# EasyEDA Pro project 4T模拟赛-董海玄.eprj

# Schematic SCH
Board Name: Board1; Create Date: 2026-03-23; Page Name: GD32 主控电路; Project Name: 4T模拟赛-董海玄; Schematic Name: SCH; Update Date: 2026-03-23
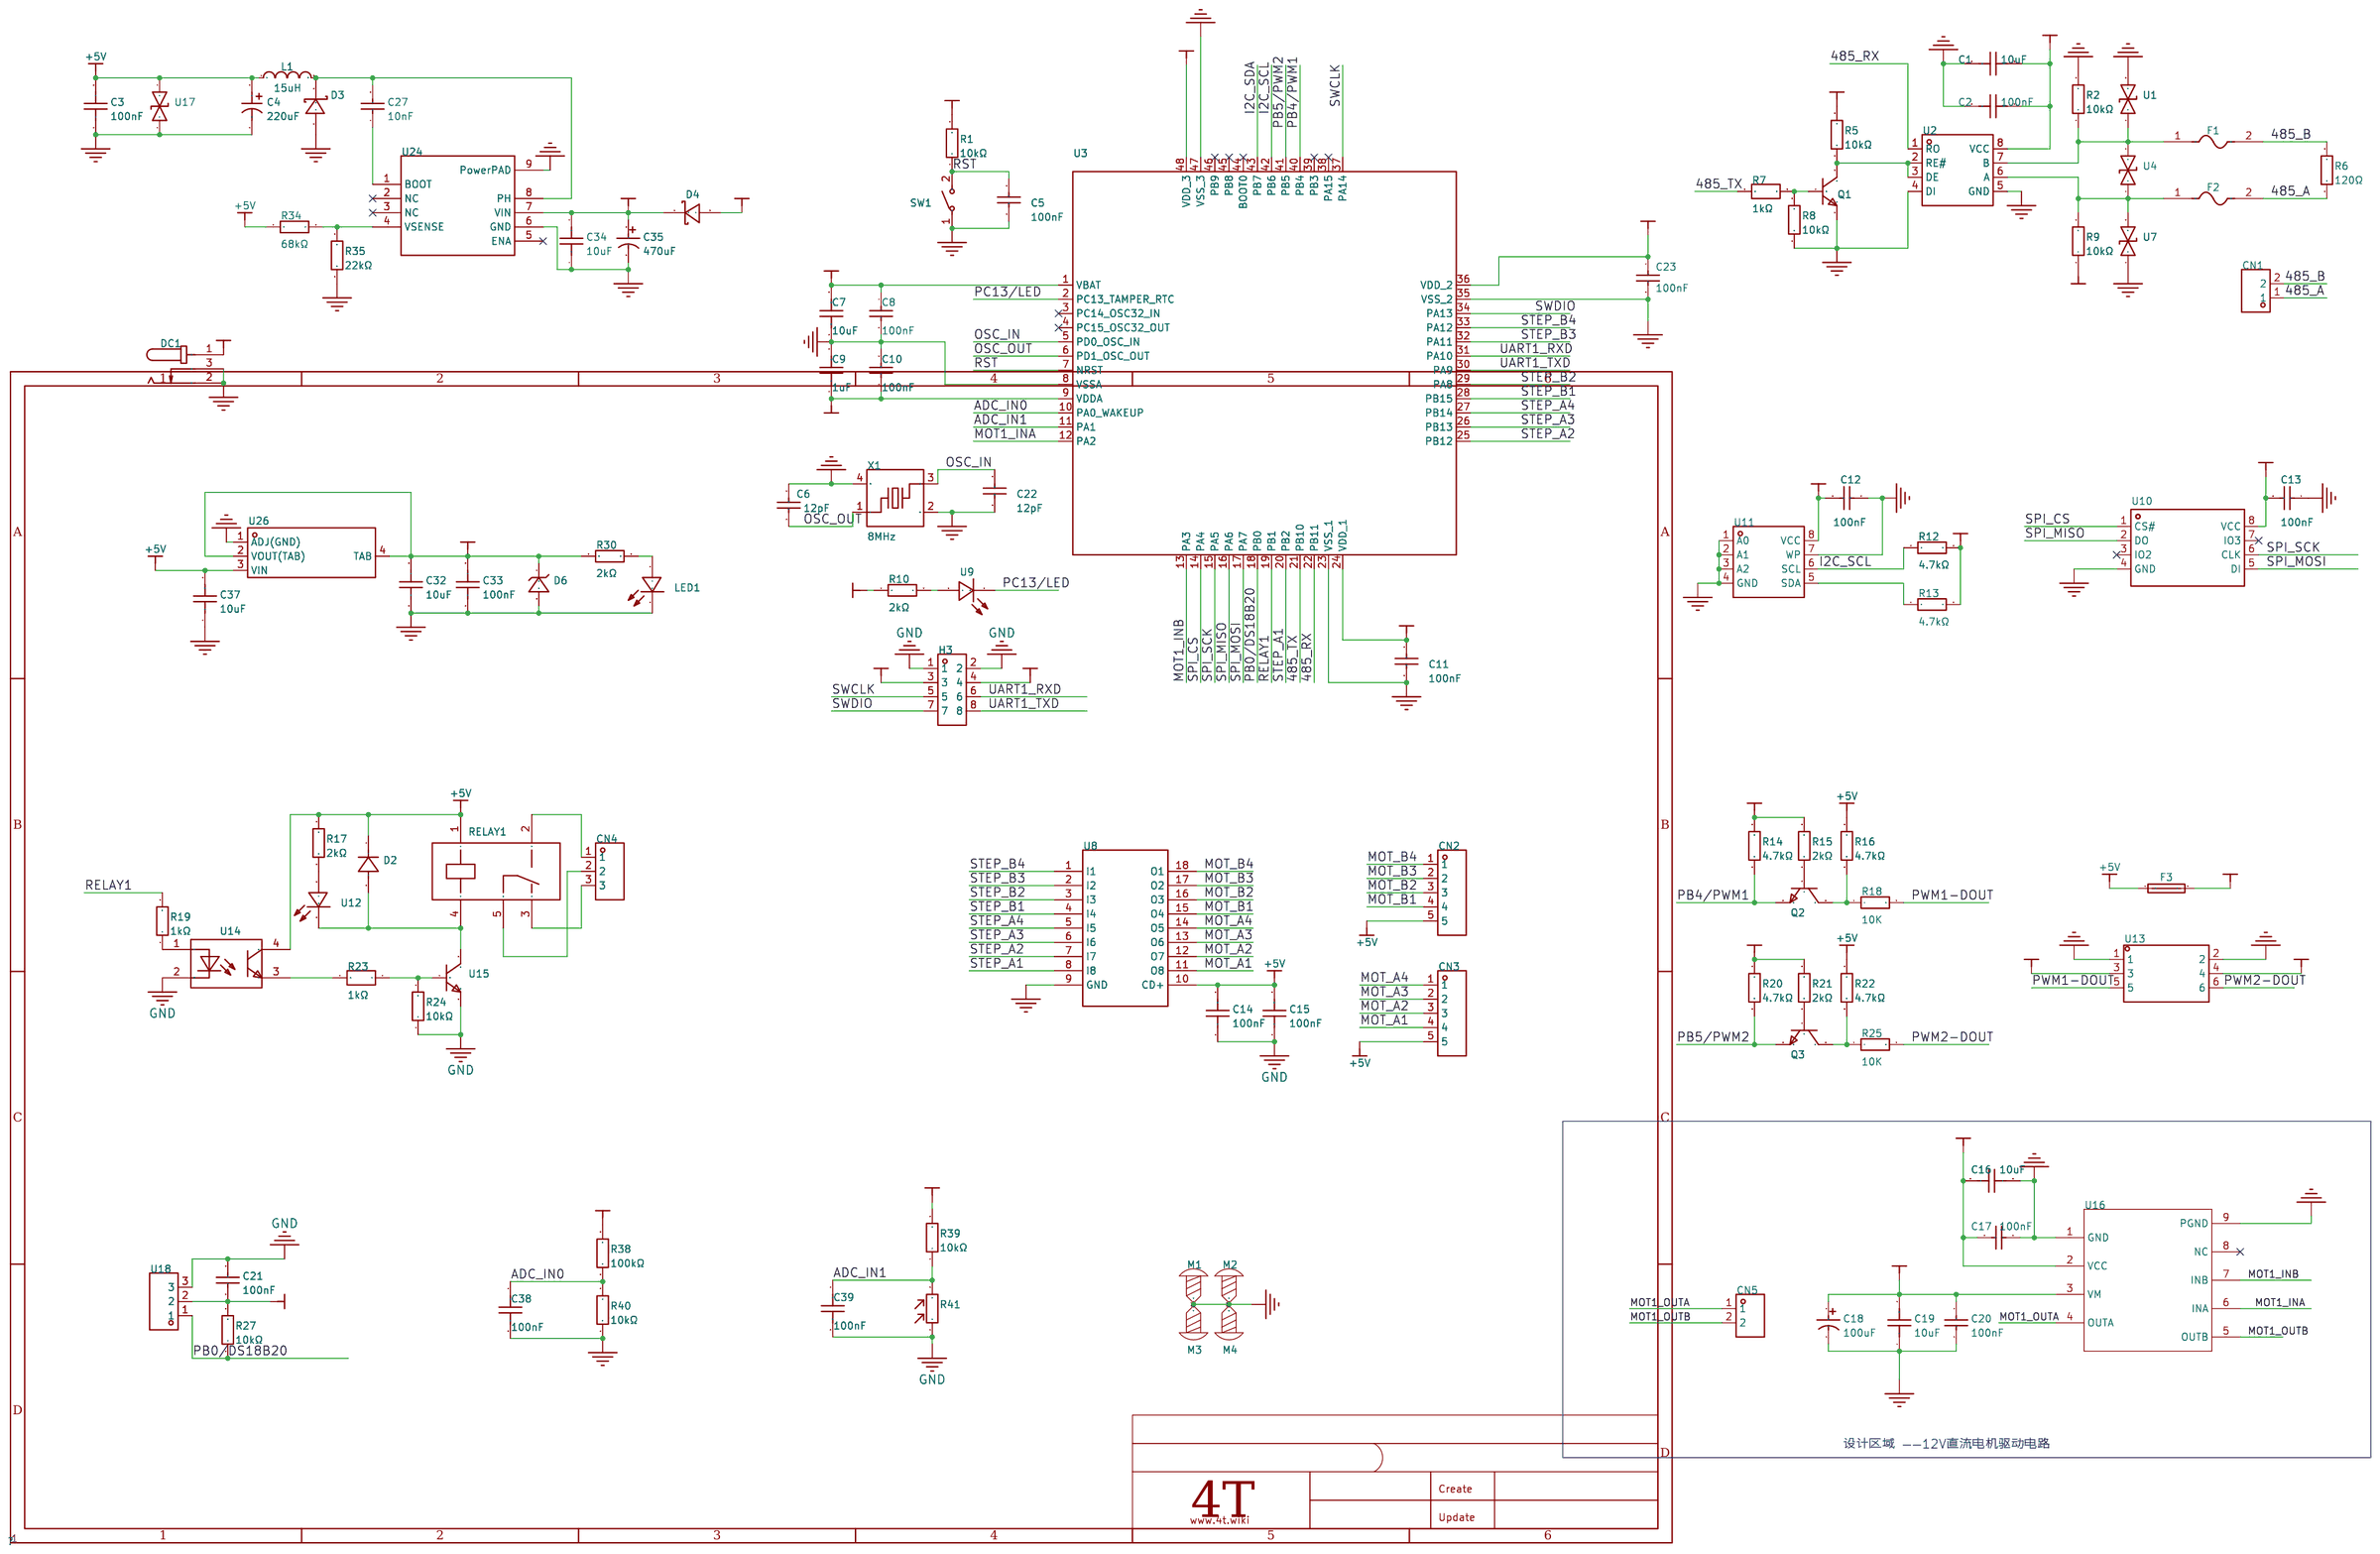
[diagram p0: schematic sheet]

## Parts
C1  10uF  [LQ_R0603]
C2  100nF  [LQ_R0603]
C3  100nF  [LQ_C0805]
C4  220uF  [LQ_CAP-SMD_BD6.3-L6.6-W6.6-LS7.3-FD-H7.7]
C5  100nF  [LQ_R0603]
C6  12pF  [LQ_R0603]
C7  10uF  [LQ_R0603]
C8  100nF  [LQ_R0603]
C9  1uF  [LQ_R0603]
C10  100nF  [LQ_R0603]
C11  100nF  [LQ_R0603]
C12  100nF  [LQ_R0603]
C13  100nF  [LQ_R0603]
C14  100nF  [LQ_C0805]
C15  100nF  [LQ_C0805]
C16  10uF  [LQ_R0603]
C17  100nF  [LQ_R0603]
C18  100uF  [LQ_CAP-SMD_BD6.3-L6.6-W6.6-LS7.3-FD-H7.7]
C19  10uF  [LQ_R0603]
C20  100nF  [LQ_R0603]
C21  100nF  [LQ_R0603]
C22  12pF  [LQ_R0603]
C23  100nF  [LQ_R0603]
C27  10nF  [LQ_R0603]
C32  10uF  [LQ_R0603]
C33  100nF  [LQ_R0603]
C34  10uF  [LQ_C0805]
C35  470uF  [LQ_CAP-SMD_BD8.0-L8.3-W8.3-FD]
C37  10uF  [LQ_R0603]
C38  100nF  [LQ_R0603]
C39  100nF  [LQ_R0603]
CN1  -  [LQ_CONN-TH_2P-P5.08_DB128L-5.08-2P]
CN2  -  [LQ_CONN-TH_5P-P2.54_XH-5AW_C2908614]
CN3  -  [LQ_CONN-TH_5P-P2.54_XH-5AW_C2908614]
CN4  -  [LQ_CONN-TH_3P-P5.00_KF2EDGR-5.0-3P]
CN5  -  [LQ_CONN-TH_2P-P5.08_DB128L-5.08-2P]
D2  1N4007  [LQ_SMA_L4.3-W2.5-LS5.0-RD]
D3  SS34  [LQ_SMA_L4.3-W2.6-LS5.0-RD]
D4  SS34  [LQ_SMA_L4.3-W2.6-LS5.0-RD]
D6  -  [LQ_SMB_L4.3-W3.6-LS5.3-RD]
DC1  -  [LQ_DC-IN-TH_DC-005-A200]
F1  -  [LQ_R0805]
F2  -  [LQ_R0805]
F3  -  [LQ_R0603]
H3  -  [LQ_HDR-TH_8P-P2.54-V-F-R2-C4-S2.54-1]
L1  15uH  [LQ_IND-SMD_L10.8-W10.0_SLO1040H]
LED1  -  [LQ_LED0603-RD]
M1  -  [LQ_M3螺丝]
M2  -  [LQ_M3螺丝]
M3  -  [LQ_M3螺丝]
M4  -  [LQ_M3螺丝]
Q1  -  [LQ_SC-75-3_L1.6-W0.8-P1.00-LS1.6-BR]
Q2  S8050-J3Y  [LQ_SOT-23-3_L3.0-W1.7-P0.95-LS2.9-BR]
Q3  S8050-J3Y  [LQ_SOT-23-3_L3.0-W1.7-P0.95-LS2.9-BR]
R1  10kΩ  [LQ_R0603]
R2  10kΩ  [LQ_R0603]
R5  10kΩ  [LQ_R0603]
R6  120Ω  [LQ_R0805]
R7  1kΩ  [LQ_R0603]
R8  10kΩ  [LQ_R0603]
R9  10kΩ  [LQ_R0603]
R10  2kΩ  [LQ_R0603]
R12  4.7kΩ  [LQ_R0603]
R13  4.7kΩ  [LQ_R0603]
R14  4.7kΩ  [LQ_R0603]
R15  2kΩ  [LQ_R0603]
R16  4.7kΩ  [LQ_R0603]
R17  2kΩ  [LQ_R0603]
R18  10K  [LQ_R0603]
R19  1kΩ  [LQ_R0603]
R20  4.7kΩ  [LQ_R0603]
R21  2kΩ  [LQ_R0603]
R22  4.7kΩ  [LQ_R0603]
R23  1kΩ  [LQ_R0603]
R24  10kΩ  [LQ_R0603]
R25  10K  [LQ_R0603]
R27  10kΩ  [LQ_R0603]
R30  2kΩ  [LQ_R0603]
R34  68kΩ  [LQ_R0603]
R35  22kΩ  [LQ_R0603]
R38  100kΩ  [LQ_R0603]
R39  10kΩ  [LQ_R0603]
R40  10kΩ  [LQ_R0603]
R41  -  [LQ_RES-TH_L5.1-W4.3-P3.40-D0.5]
RELAY1  -  [LQ_RELAY-TH_SRD-XXVDC-XL-C_1]
SW1  -  [LQ_SW-SMD_L6.0-W3.3-LS8.0]
U1  -  [LQ_SOD-123FL_L2.8-W1.8-LS3.7-BI]
U2  -  [LQ_SOP-8_L4.9-W3.9-P1.27-LS6.0-BL]
U3  -  [LQ_TQFP-48_L7.0-W7.0-P0.50-LS9.0-BL]
U4  -  [LQ_SOD-123FL_L2.8-W1.8-LS3.7-BI]
U7  -  [LQ_SOD-123FL_L2.8-W1.8-LS3.7-BI]
U8  -  [LQ_DIP-18_L23.0-W6.5-P2.54-LS7.6-BL]
U9  -  [LQ_LED-TH_BD3.9-P2.54-RD_GREEN]
U10  -  [LQ_SOIC-8_L5.3-W5.3-P1.27-LS8.0-BL]
U11  AT24C02  [LQ_SOP-8_L4.9-W3.9-P1.27-LS6.0-BL]
U12  -  [LQ_LED-TH_BD3.9-P2.54-RD_GREEN]
U13  -  [LQ_HDR-TH_6P-P2.54-H-R2-C3-S2.54-W10.0_MTP125-203R1]
U14  GX817C-S  [LQ_SOP-4_L6.5-W4.6-P2.54-LS10.2-TR]
U15  -  [LQ_SOT-23-3_L2.9-W1.3-P1.90-LS2.4-BR]
U16  -  [ESOP]
U17  -  [LQ_SOD-123FL_L2.8-W1.8-LS3.7-BI]
U18  -  [LQ_CONN-TH_3P-P5.08_DIBO_DB128V-5.08-3P-X]
U24  -  [LQ_ESOP-8_L4.9-W3.9-P1.27-LS6.0-TL-EP]
U26  -  [SOT-223-4_L6.5-W3.5-P2.30-LS7.0-BR]
X1  8MHz  [LQ_OSC-SMD_4P-L3.2-W2.5-BL]

## Library data of the parts
C1 C2 C5-C13 C16 C17 C19-C23 C27 C32 C33 C37-C39 = CAP_0603: Rect,100,35
C3 C14 C15 C34 = CAP_0805: Rect,130,53
C4 C18 = JVJ50V100M6x8: Round,260; LCSC Part Name: 100uF ±20% 50V; Supplier Footprint: SMD,D6.3xL7.7mm; JLCPCB Part Class: 扩展库; Datasheet: https://atta.szlcsc.com/upload/public/pdf/source/20250307/5A84A08C3F2F96A6D3F2CE3F7352019C.pdf; Tolerance: ±20%; Voltage Rating: 50V; Ripple Current: 140mA@100Hz; Diameter: 6.3mm; Height - Seated (Max): 7.7mm; Lifetime: 2000hrs@105℃; Operating Temperature: -55℃~+105℃
C35 = VT1V221M0810: Round,314; LCSC Part Name: 220uF ±20% 35V; Supplier Footprint: SMD,D8xL10.2mm; Datasheet: https://atta.szlcsc.com/upload/public/pdf/source/20181008/C310848_86A97ADD3BC640D301817E47C029682B.pdf; Tolerance: ±20%; Rated Voltage: 35V; φD: 8mm; L: 10.2mm; Lifetime @ Temp: 2000hrs@105℃; Operating Temperature: -45℃~+105℃
CN1 CN5 = DB128L-5.08-2P-GN-S: Rect,383,380; LCSC Part Name: 5.08mm 1x2P 排数:1 每排P数:2 直插; Supplier Footprint: 插件,P=5.08mm; Datasheet: https://atta.szlcsc.com/upload/public/pdf/source/20230106/B067FE0E641A396A370D47F93C345689.pdf; Structure: 1x2P; Pitch: 5.08mm; Color: 绿色; Mounting Style: 直插; Current Rating (Max): 18A; Voltage Rating (Max): 250V; Number of Pins: 2P; Number of Rows: 1; Wire Gauge - AWG: 12~30; Wire Gauge - mm2: 2.5; Number of PINs Per Row: 2; Operating Temperature Range: -40℃~+105℃
CN2 CN3 = XH-5AW: Rect,570,274; LCSC Part Name: 1x5P 间距:2.54mm 弯插 系列:XH; Supplier Footprint: 弯插,P=2.5mm; Datasheet: https://atta.szlcsc.com/upload/public/pdf/source/20230711/B565BAF3B11666EF6B81B3605408F2BD.pdf; Pins Structure: 1x5P; Pitch: 2.54mm; Mounting Style: 弯插; Reference Series: XH; Number of Pins: 5P; Number of Rows: 1; Number of PINs Per Row: 5; Current Rating (Max): 3A; Contact Material: 黄铜; Contact Plating: 锡; Operating Temperature Range: -25℃~+85℃
CN4 = KF2EDGR-5.0-3P: Rect,588,461; LCSC Part Name: 5mm 1x3P 排数:1 每排P数:3; Supplier Footprint: 弯插,P=5mm; Datasheet: https://atta.szlcsc.com/upload/public/pdf/source/20230331/48F85325430F02148BE2AB264324A8EA.pdf; Connector Type: 板端/插座-开口; Structure: 1x3P; Pitch: 5mm; Color: 绿色; Mounting Style: 弯针; Number of Pins: 3P; Number of Rows: 1; Number of PINs Per Row: 3; Current Rating (Max): 15A; Voltage Rating (Max): 300V; Operating Temperature Range: -40℃~+105℃
D2 = 1N4007_C727081: Rect,237,58; LCSC Part Name: 1kV 1A 1.1V@1A; Supplier Part: C727081; Manufacturer: TWGMC(台湾迪嘉); Supplier Footprint: SMA(DO-214AC); Datasheet: https://atta.szlcsc.com/upload/public/pdf/source/20200828/C727079_3A05254382567072883400655AE0ED46.pdf; Supplier: LCSC; Diode Configuration: 独立式; Reverse Voltage (Vr): 1kV; Average Rectified Current (Io): 1A; Forward Voltage (Vf@If): 1.1V@1A; Reverse Leakage Current: 5μA@1kV
D3 D4 = SS34: Rect,184,107; Supplier Part: C9900023345; Supplier Footprint: SMA,DO-214AC; Supplier: LCSC
D6 = SMBJ3.3A_C2990571: Rect,190,130; LCSC Part Name: SMBJ3.3A; Supplier Footprint: SMB(DO-214AA); Datasheet: https://atta.szlcsc.com/upload/public/pdf/source/20180716/C29715_E6EABBF81195B419C59879CD6F1DD929.pdf; Reverse Stand-Off Voltage (Vrwm): 3.3V; Maximum Clamping Voltage: 7.2V; Peak Pulse Current (Ipp)@10/1000us: 42A; Peak Pulse Power Dissipation (Ppp)@10/1000us: 300W; Breakdown Voltage: 4V; Reverse Leakage Current (Ir): 10uA; Type: TVS
DC1 = DC-005-A200: Rect,533,335; LCSC Part Name: DC电源插座 内径:2mm 外径:6.4mm; Supplier Footprint: 插件; JLCPCB Part Class: 扩展库; Datasheet: https://atta.szlcsc.com/upload/public/pdf/source/20200812/C720557_2286DFCD6C75B71AF905731F627ABF3A.pdf; Connector Type: DC电源插座; Mounting Style: 弯插; Inside Contact Diameter: 2mm; Outside Contact Diameter: 6.4mm; Current Rating (Max): 3A; Voltage Rating (Max): 30V; Operating Temperature Range: -20℃~+70℃
F1 F2 = 0805L100/12AR: Rect,154,63; LCSC Part Name: 12V 1A 0805自恢复; Supplier Footprint: 0805; Datasheet: https://atta.szlcsc.com/upload/public/pdf/source/20230807/C79B608779D6C1962D0609D5DE753A5D.pdf; Operating Voltage (Max): 12V; Current Rating (Max): 40A; Hold Current: 1A; Trip Current: 2A; Power Dissipation: 800mW; Resistance - Initial (Ri) (Min): 40mΩ; Resistance - Post Trip (R1) (Max): 270mΩ; Maximum Time to Trip: 300ms; Operating Temperature: -40℃~+85℃
F3 = BSMD0603L-100: Rect,86,27; LCSC Part Name: 6V 1A 0603自恢复; Supplier Footprint: 0603; Datasheet: https://atta.szlcsc.com/upload/public/pdf/source/20230512/417309B2F369BEFF09D3B47B4F479194.pdf; Operating Voltage (Max): 6V; Current Rating (Max): 50A; Hold Current: 1A; Trip Current: 2A; Power Dissipation: 1W; Resistance - Initial (Ri) (Min): 9mΩ; Resistance - Post Trip (R1) (Max): 80mΩ; Maximum Time to Trip: 500ms; Operating Temperature: -40℃~+85℃
H3 = HDR-F_2.54_2x4: Rect,405,186; Supplier Footprint: 插件
L1 = SLO1040H470MTT: Rect,431,399; LCSC Part Name: 47uH ±20%; Supplier Footprint: SMD; JLCPCB Part Class: 扩展库; Datasheet: https://atta.szlcsc.com/upload/public/pdf/source/20201009/C207854_ACA4210DD273ACBB198904FC5A3A8806.pdf; Tolerance: ±20%; Rated Current: 3A; DC Resistance (DCR): 145mΩ
LED1 = KT-0603R: Rect,92,33; LCSC Part Name: 0603 红灯 高亮; Supplier Footprint: 0603; Datasheet: https://atta.szlcsc.com/upload/public/pdf/source/20160616/1466072038404.pdf; Emitted Color: 红色; Operating Temperature: -40℃~+85℃
M1-M4 = M3螺丝孔: Round,210
Q1 = MMBT3904TT1G: Rect,29,63; LCSC Part Name: NPN 电流:200mA 耐压:40V; Supplier Footprint: SOT-416; Datasheet: https://atta.szlcsc.com/upload/public/pdf/source/20221020/8C70A8ED36C1D333CEA0E7EE045B4434.pdf; Transistor Type: NPN; Collector Current (Ic): 200mA; Collector-Emitter Breakdown Voltage (Vceo): 40V; Power Dissipation (Pd): 200mW; DC Current Gain (hFE@Ic,Vce): 100@0.1mA,1.0V; Transition Frequency (fT): 300MHz; Collector Cut-Off Current (Icbo): 50nA; Collector-Emitter Saturation Voltage (VCE(sat)@Ic,Ib): 200mV@10mA,1.0mA; Operating Temperature: -65℃~+150℃
Q2 Q3 = S8050-J3Y: Rect,67,120; Pin Type: IN
R1 R2 R5 R7-R10 R12-R25 R27 R30 R34 R35 R38-R40 = Res_0603: Rect,95,37
R6 = Res_0805: Rect,125,54
R41 = GL5528: Round,162; LCSC Part Name: 亮电阻:8kΩ~20kΩ 暗电阻:1MΩ; Supplier Footprint: 插件,P=3mm; Datasheet: https://atta.szlcsc.com/upload/public/pdf/source/20230427/842A99E3D53A83729D7968886D4EFCBB.pdf; Dark Resistance: 1MΩ; Illuminated Resistance @ 10Lux: 8kΩ~20kΩ; Applied Voltage: 150V; Spectral Peak: 540nm
RELAY1 = SRD-12VDC-SL-C: Rect,740,600; Supplier Footprint: 插件,15.6x19.2mm; Datasheet: https://atta.szlcsc.com/upload/public/pdf/source/20200305/C490149_C96E4098A3B1FFB377D5AD2E40B7C2A8.pdf; Coil Voltage: 12V; Contact Form: 一组转换:1C(单刀双掷-转换); Pin Number: 5; Maximum Switching Voltage: 250V@AC; Coil Rated Power: 360mW; Maximum Switching Current: 15A; Coil Type: 无极性-单线圈; Coil Resistance: 400Ω; Contact Resistance: 100mΩ; Operate Time: 10ms; Release Time: 10ms
SW1 = TS-1101-C-W: Rect,236,129; LCSC Part Name: 6*3.6*2.5mm 立贴 轻触开关; Supplier Footprint: SMD; Datasheet: https://atta.szlcsc.com/upload/public/pdf/source/20200227/C318938_C2E53B1EEDE37D980A33616AC086DE53.pdf; Circuit: 单刀单掷; Actuator Style: 矩形按钮; Operating Force: 260gf; Mounting Style: 立贴; Switch Length: 6mm; Switch Width: 3.6mm; Switch Height: 2.5mm; Strike Gundam: 不带; Contact Current: 50mA; Voltage Rating (DC): 12V; Actuator/Cap Color: 白色带淡绿; With Lamp: 无; Mechanical Life: 5万次; Operating Temperature: -30℃~+85℃
U1 U4 U7 U17 = SMF6.0CA_C2990473: Rect,173,48; LCSC Part Name: SMF6.0CA; Supplier Footprint: SOD-123FL; Datasheet: https://atta.szlcsc.com/upload/public/pdf/source/20231227/BBF9EE757846DE4D601D73FF261316E0.pdf; Reverse Stand-Off Voltage (Vrwm): 6V; Maximum Clamping Voltage: 10.3V; Peak Pulse Current (Ipp)@10/1000us: 19.4A; Peak Pulse Power Dissipation (Ppp)@10/1000us: 200W; Breakdown Voltage: 6.67V; Reverse Leakage Current (Ir): 400uA; Type: TVS
U2 = SP3485EN-MS: Rect,196,115; Supplier Footprint: SOP-8; Datasheet: https://atta.szlcsc.com/upload/public/pdf/source/20230802/AC5CE9B297C842978E478FFAEC87FC06.pdf; Types: 收发器; Supply Voltage: 3V~5.5V; Data Rate: 12Mbps; Driver/receiver: 1/1; Node Number: 256; Operating Temperature: -40℃~+125℃
U3 = GD32F103C8T6: Rect,216,216; LCSC Part Name: Arm® Cortex®-M3 32-bit MCU; Supplier Footprint: LQFP-48(7x7); Datasheet: https://item.szlcsc.com/datasheet/GD32F103C8T6/79128.html; CPU Core: ARM Cortex-M3; CPU Maximum Speed: 108MHz; Program Storage Size: 64KB; Program Memory Type: FLASH; Number of I/O: 37; ADC (Bit): 12bit; Voltage - Supply: 2.6V~3.6V
U8 = ULN2803G-D18-T: Rect,889,235; Supplier Footprint: DIP-18; Datasheet: https://atta.szlcsc.com/upload/public/pdf/source/20160620/1466410514366.pdf; number of channels: 八路
U9 U12 = L-3N4GD: Round,140; Supplier Footprint: 插件,D=3mm; Datasheet: https://atta.szlcsc.com/upload/public/pdf/source/20220613/52FE11107FC1247DC989221133187A30.pdf; Lamp Holder Type: 3mm圆柱形灯头
U10 = W25Q128JVSIQ: Rect,207,171; LCSC Part Name: W25Q128JVSIQ 编带; Supplier Footprint: SOIC-8-208mil; JLCPCB Part Class: 基础库; Datasheet: https://atta.szlcsc.com/upload/public/pdf/source/20170316/1489627409956.pdf; Interface Type: SPI; Memory Size: 128Mbit; Clock Frequency (fc): 133MHz; Supply Voltage: 2.7V~3.6V; Page Programming Time (Tpp): 700us; Block Erase Time (tBE): 120ms@(32KB); Data Retention - TDR (Year): 20年; Operating Temperature: -40℃~+85℃
U11 = AT24C02: Rect,196,115; link: https://so.szlcsc.com/global.html?k=C356696&ref=editor
U13 = MTP125-1203R1: Rect,250,529; LCSC Part Name: 2.54mm 2x3P 弯插 方针; Supplier Footprint: 弯插,P=2.54mm; Datasheet: https://atta.szlcsc.com/upload/public/pdf/source/20190124/C358705_93D7A3916447F5E30395220E465CA216.pdf; Number of Rows: 双排; Number of Pins: 6; Pitch: 2.54mm; Pin Structure: 2x3P; Row Spacing: 2.54mm; Mounting Type: 弯插; Circluar Pins/Square Pins: 方针; Length of Mating Pin: 6mm; Insulation Height: 2.5mm; Contact Material: 黄铜; Operating Temperature Range: -40℃~+105℃; Color: 黑色
U14 = GX817C-S: Rect,154,463; LCSC Part Name: DC输入 隔离电压(rms):5000V; Supplier Part: C2684625; Manufacturer: 国芯佳品; Supplier Footprint: SOP-4-2.54mm; Datasheet: https://atta.szlcsc.com/upload/public/pdf/source/20210129/C2684625_70920EABE5B67CAA0A333F7D1CED43F0.pdf; Supplier: LCSC; Input voltage type: DC; Output Type: 光电三极管; Number of Outputs: 1; Forward Voltage: 1.2V; Reverse Voltage: 6V; Output Current: 50mA; Receiving End Voltage: 35V; Collector-Emitter Saturation Voltage (Vce(sat)@Ic,IF): 100mV@1mA,20mA; Rise time: 18us@2mA,100Ω; Fall time: 18us@2mA,100Ω; Isolation Voltage(rms): 5kV; Operating Temperature: -55℃~+110℃
U15 = SS8050_C7420370: Rect,53,116; LCSC Part Name: 耐压:25V 电流:1.5A NPN H档 200-350; Supplier Footprint: SOT-23; Datasheet: https://atta.szlcsc.com/upload/public/pdf/source/20231222/9C4050A7669EB24B3ACD0418218817FD.pdf; Transistor Type: NPN; Collector Current (Ic): 1.5A; Collector-Emitter Breakdown Voltage (Vceo): 25V; Power Dissipation (Pd): 300mW; DC Current Gain (hFE@Ic,Vce): 120@100mA,1.0V; Transition Frequency (fT): 100MHz; Collector Cut-Off Current (Icbo): 100nA; Collector-Emitter Saturation Voltage (VCE(sat)@Ic,Ib): 500mV@800mA,80mA; Operating Temperature: -55℃~+150℃
U16 = BDR
U18 = DB128V-5.08-3P-GN-S: Rect,600,394; LCSC Part Name: 1x3P 5.08mm 直插 排数:1 每排P数:3; Supplier Footprint: 插件,P=5.08mm; JLCPCB Part Class: 扩展库; Datasheet: https://atta.szlcsc.com/upload/public/pdf/source/20230106/CC449C10514519CDCE20F1C37DBF2DAC.pdf; Number of Positions or Pins: 1x3P; Pitch: 5.08mm; Color: 绿色; Mounting Type: 直插; Number of Pins: 3P; Number of Rows: 1; Number of PINs Per Row: 3; Screw Specification: M2.5; Current Rating: 16A; Voltage Rating (Max): 300V; Wire Gauge - AWG: 12~22; Wire Gauge - mm2: 2.5; Operating Temperature: -40℃~+105℃
U24 = TPS5430DDAR: Rect,159,190; LCSC Part Name: 宽输入范围、3A输出电流的降压转换器; Supplier Footprint: SOIC-8-EP; Datasheet: https://www.ti.com/cn/lit/gpn/tps5430; Function: 降压型; Output Type: 可调; Input Voltage: 5.5V~36V; Output Voltage: 1.221V~32.04V; Output Current: 3A; Switching Frequency: 500kHz; Operating Temperature: -40℃~+125℃@(TJ); Synchronous Rectification: 否; Number of Outputs: 1; Topology: 降压式; Switch tube (built-in/external): 内置
U26 = AMS1117-1.8_C6185: Rect,90,248; LCSC Part Name: 正 Vin=15V Vout=1.8V~1.8V 1A 75dB@(120Hz); Supplier Footprint: SOT-223-4; Datasheet: https://atta.szlcsc.com/upload/public/pdf/source/20180727/C6186_7A095716F0823C02F1997A905E26C086.pdf; Output Type: 固定; Output Polarity: 正; Number of Outputs: 1; Maximum Input Voltage: 15V; Output Voltage: 1.8V~1.8V; Dropout Voltage: 1.3V@(1A); Output Current: 1A; Power Supply Rejection Ratio (PSRR): 75dB@(120Hz)
X1 = X322512MSB4SI: Rect,159,130; LCSC Part Name: 12MHz ±10ppm 20pF; Supplier Footprint: SMD3225-4P; Datasheet: https://atta.szlcsc.com/upload/public/pdf/source/20240329/19D5F850207469550BEB00D7DFEDBC7A.pdf; Crystal Type: 贴片晶振; Normal temperature Frequency Tolerance: ±10ppm; External load capacitor: 20pF; Frequency Stability(Full temperature range): ±20ppm; Operating Temperature: -40℃~+85℃

## Nets
3V3: C1.1 C2.1 C7.2 C8.1 C9.1 C10.1 C11.1 C12.1 C13.2 C16.1 C17.2 C21.2 C23.1 C32.2 C33.2 D6.1(C) H3.3 H3.4 R1.2 R5.2 R9.1 R10.1 R12.2 R13.2 R14.1 R15.2 R20.1 R21.2 R27.2 R30.2 R39.2 U2.8(VCC) U3.1(VBAT) U3.9(VDDA) U3.24(VDD_1) U3.36(VDD_2) U3.48(VDD_3) U10.8(VCC) U11.8(VCC) U16.2(VCC) U18.2 U26.2(VOUT(TAB)) U26.4(TAB)
+5V: C3.2 C4.1 C14.2 C15.2 C37.2 CN2.5 CN3.5 D2.1(K) F3.1 L1.1 R16.1 R17.1 R22.1 R34.1 RELAY1.1 U8.10(CD+) U14.4(C) U17.1 U26.3(VIN)
+5V-OUT: F3.2 U13.3 U13.4
+12V: C18.1 C19.2 C20.1 C34.2 C35.1 D4.1(K) U16.3(VM) U24.7(VIN)
GND: C1.2 C2.2 C3.1 C4.2 C5.2 C6.2 C7.1 C8.2 C9.2 C10.2 C11.2 C12.2 C13.1 C14.1 C15.1 C16.2 C17.1 C18.2 C19.1 C20.2 C21.1 C22.1 C23.2 C32.1 C33.1 C34.1 C35.2 C37.1 C38.2 C39.2 D3.2(A) D6.2(A) DC1.2 DC1.3 H3.1 H3.2 LED1.1(K) M1.1 M2.1 M3.1 M4.1 Q1.2(E) R2.2 R8.1 R24.1 R35.1 R40.1 R41.1 SW1.1 U1.2 U2.4(DI) U2.5(GND) U3.8(VSSA) U3.23(VSS_1) U3.35(VSS_2) U3.47(VSS_3) U7.1 U8.9(GND) U10.4(GND) U11.1(A0) U11.2(A1) U11.3(A2) U11.4(GND) U11.7(WP) U13.1 U13.2 U14.2(C) U15.2(E) U16.1(GND) U16.9(PGND) U17.2 U18.3 U24.6(GND) U24.9(PowerPAD) U26.1(ADJ(GND)) X1.2(GND) X1.4(GND)
VIN: D4.2(A) DC1.1 R38.2
485_A: CN1.1 F2.2 R6.1
485_B: CN1.2 F1.2 R6.2
485_RX: U2.1(RO) U3.22(PB11)
485_TX: R7.1 U3.21(PB10)
ADC_IN0: C38.1 R38.1 R40.2 U3.10(PA0_WAKEUP)
ADC_IN1: C39.1 R39.1 R41.2 U3.11(PA1)
I2C_SCL: R12.1 U3.42(PB6) U11.6(SCL)
I2C_SDA: U3.43(PB7)
MOT1_INA: U3.12(PA2) U16.6(INA)
MOT1_INB: U3.13(PA3) U16.7(INB)
MOT1_OUTA: CN5.1 U16.4(OUTA)
MOT1_OUTB: CN5.2 U16.5(OUTB)
MOT_A1: CN3.4 U8.11(O8)
MOT_A2: CN3.3 U8.12(O7)
MOT_A3: CN3.2 U8.13(O6)
MOT_A4: CN3.1 U8.14(O5)
MOT_B1: CN2.4 U8.15(O4)
MOT_B2: CN2.3 U8.16(O3)
MOT_B3: CN2.2 U8.17(O2)
MOT_B4: CN2.1 U8.18(O1)
OSC_IN: C22.2 U3.5(PD0_OSC_IN) X1.3
OSC_OUT: C6.1 U3.6(PD1_OSC_OUT) X1.1
PB0/DS18B20: R27.1 U3.18(PB0) U18.1
PB4/PWM1: Q2.2 R14.2 U3.40(PB4)
PB5/PWM2: Q3.2 R20.2 U3.41(PB5)
PC13/LED: U3.2(PC13_TAMPER_RTC) U9.1(C)
PWM1-DOUT: R18.2 U13.5
PWM2-DOUT: R25.2 U13.6
RELAY1: R19.2 U3.19(PB1)
RST: C5.1 R1.1 SW1.2 U3.7(NRST)
SPI_CS: U3.14(PA4) U10.1(CS#)
SPI_MISO: U3.16(PA6) U10.2(DO)
SPI_MOSI: U3.17(PA7) U10.5(DI)
SPI_SCK: U3.15(PA5) U10.6(CLK)
STEP_A1: U3.20(PB2) U8.8(I8)
STEP_A2: U3.25(PB12) U8.7(I7)
STEP_A3: U3.26(PB13) U8.6(I6)
STEP_A4: U3.27(PB14) U8.5(I5)
STEP_B1: U3.28(PB15) U8.4(I4)
STEP_B2: U3.29(PA8) U8.3(I3)
STEP_B3: U3.32(PA11) U8.2(I2)
STEP_B4: U3.33(PA12) U8.1(I1)
SWCLK: H3.5 U3.37(PA14)
SWDIO: H3.7 U3.34(PA13)
UART1_RXD: H3.6 U3.31(PA10)
UART1_TXD: H3.8 U3.30(PA9)
$1N1864: R10.2 U9.2(A)
$1N51292: Q3.1 R21.1
$1N51297: Q3.3 R22.2 R25.1
$1N64291: Q1.3(C) R5.1 U2.2(RE#) U2.3(DE)
$1N64303: F1.1 R2.1 U1.1 U2.7(B) U4.2
$1N64306: F2.1 R9.2 U2.6(A) U4.1 U7.2
$1N64546: Q1.1(B) R7.2 R8.2
$1N100307: R23.2 U14.3(E)
$1N100313: CN4.3 RELAY1.3
$1N100314: R23.1 R24.2 U15.1(B)
$1N100315: D2.2(A) RELAY1.4 U12.1(C) U15.3(C)
$1N100316: CN4.1 RELAY1.2
$1N100317: CN4.2 RELAY1.5
$1N101166: R19.1 U14.1(A)
$1N101509: Q2.1 R15.1
$1N101514: Q2.3 R16.2 R18.1
$1N108709: R17.2 U12.2(A)
$1N118569: LED1.2(A) R30.1
$1N118588: C27.2 D3.1(K) L1.2 U24.8(PH)
$1N118591: R34.2 R35.2 U24.4(VSENSE)
$1N118592: C27.1 U24.1(BOOT)
Net-(R13-1): R13.1 U11.5(SDA)

Not connected (* = marked no-connect by the designer): U3 3(PC14_OSC32_IN)* 4(PC15_OSC32_OUT)* 38(PA15)* 39(PB3)* 44(BOOT0)* 45(PB8)* 46(PB9)*; U10 3(IO2)* 7(IO3)*; U16 8(NC)*; U24 2(NC)* 3(NC)* 5(ENA)*

## Notes on the sheet
- 设计区域 ——12V直流电机驱动电路

# Board PCB
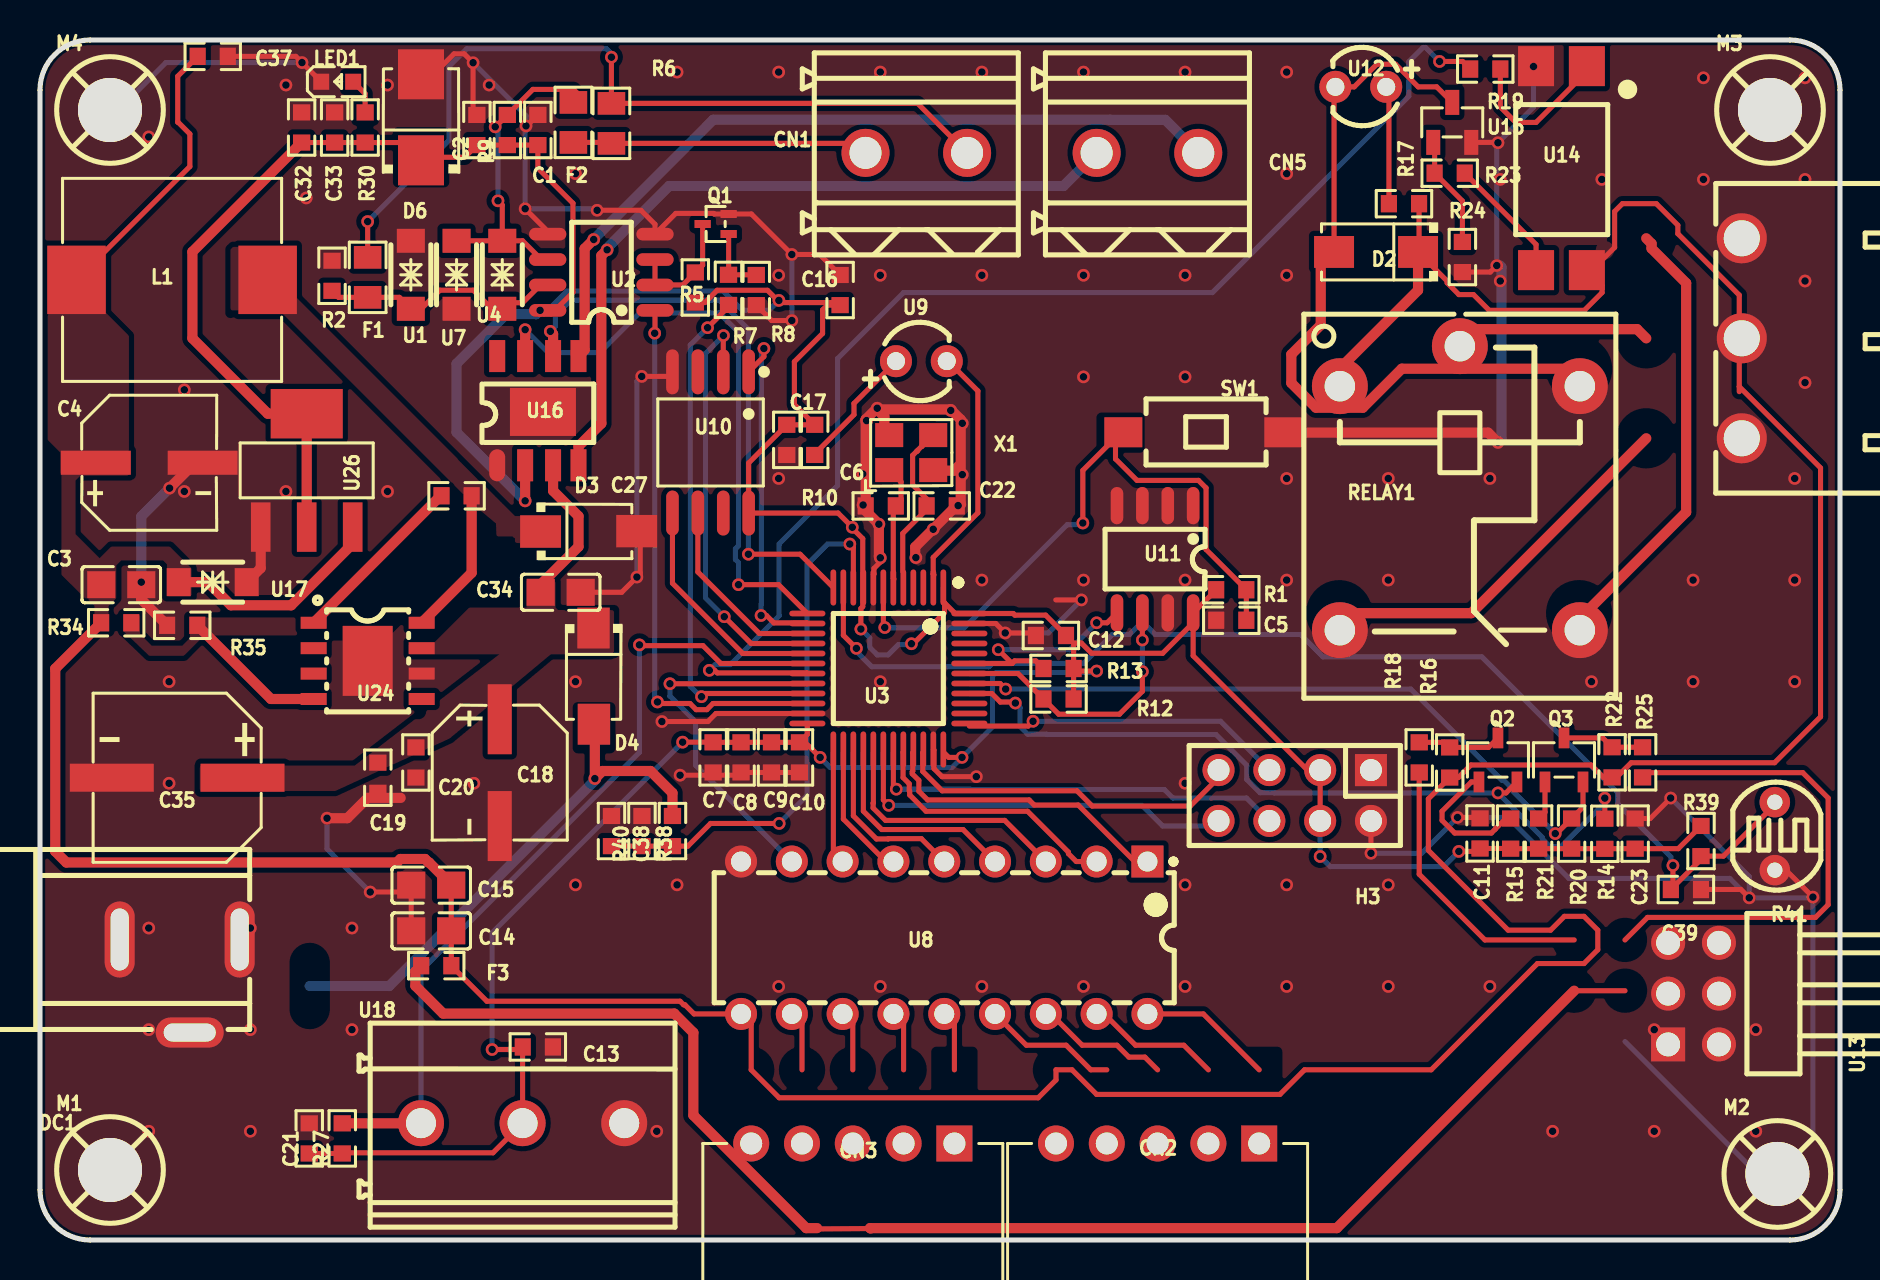
[diagram p1: board, top side]
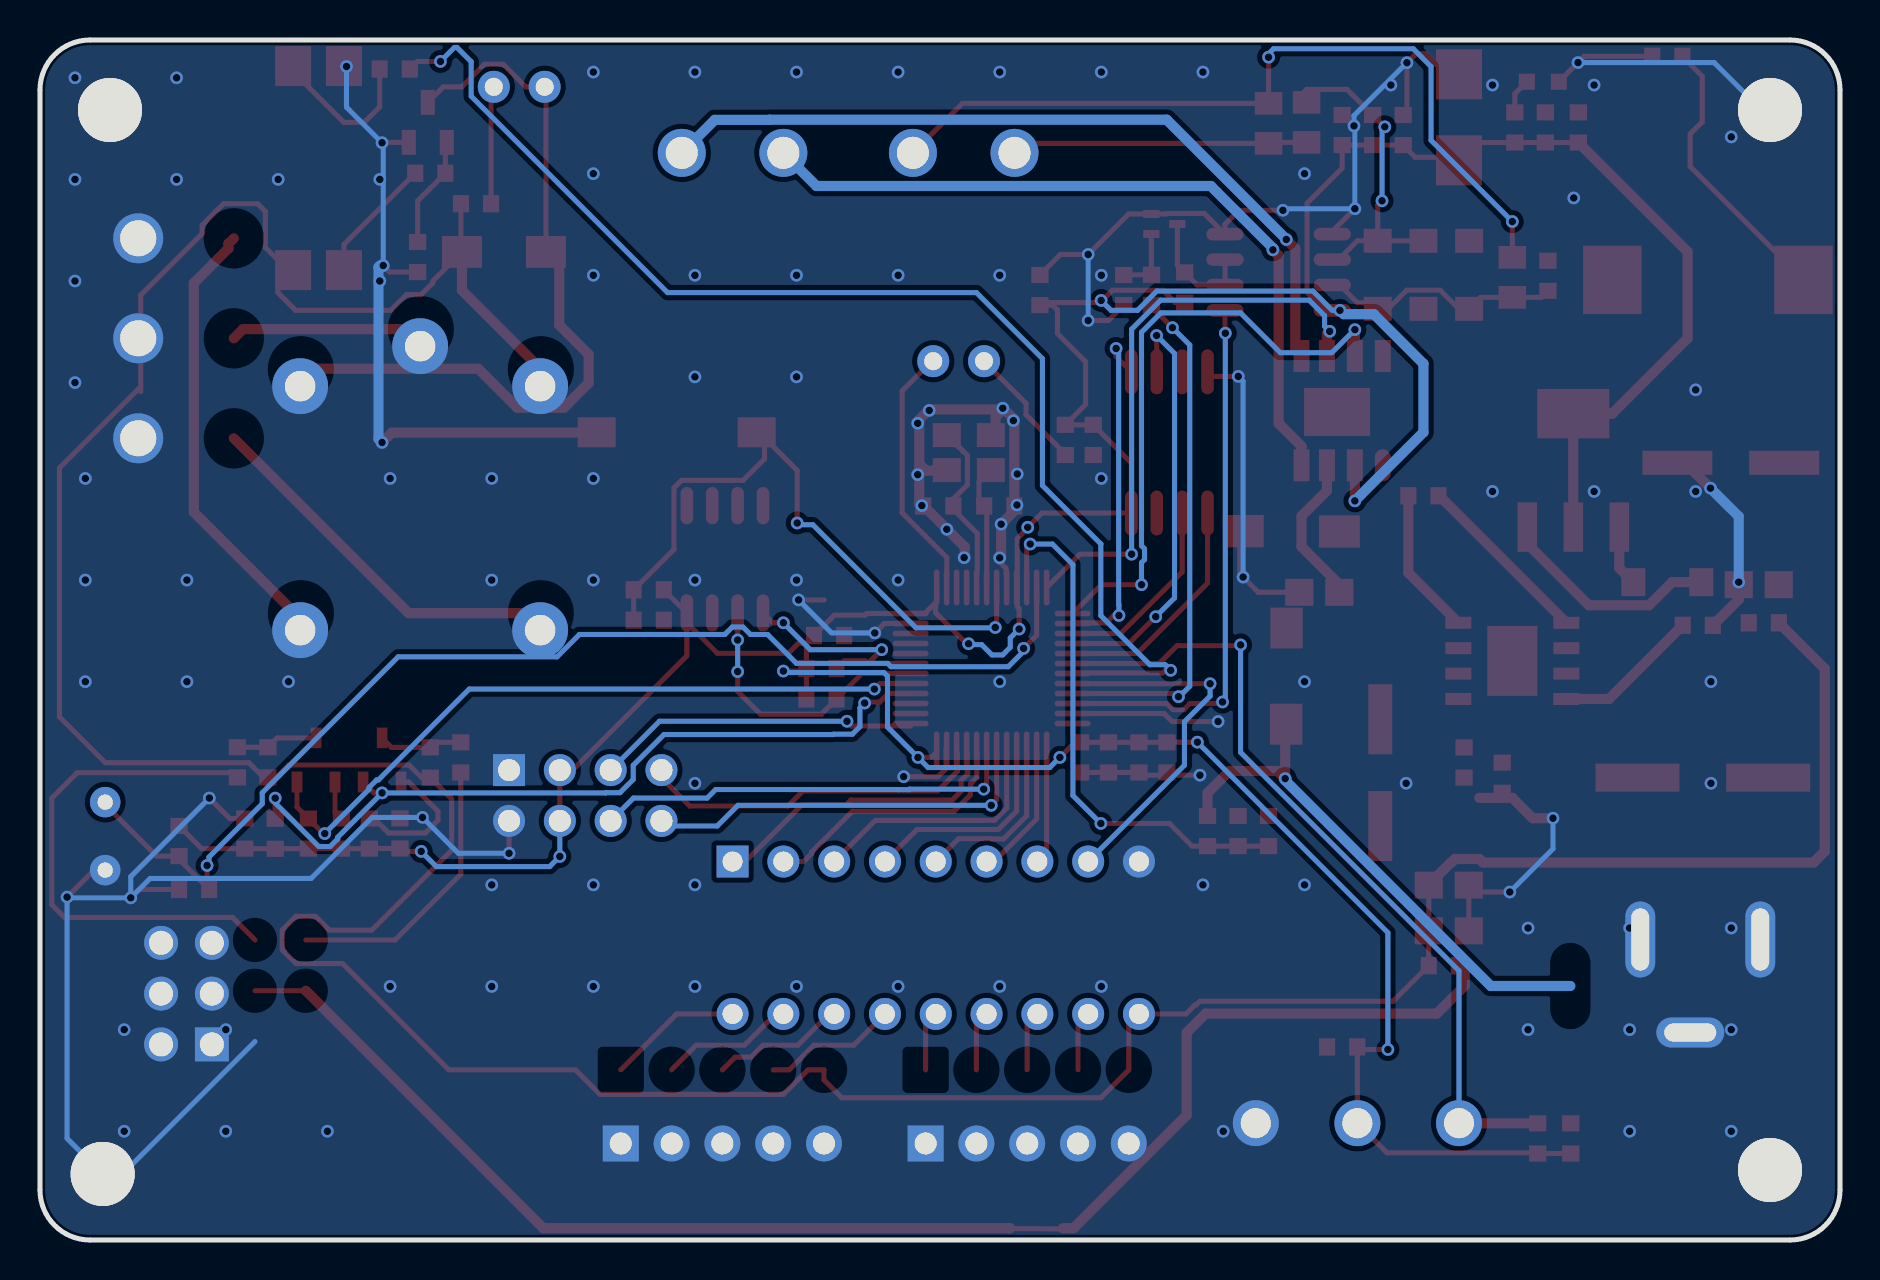
[diagram p2: board, bottom side, seen from below]

Outline 90 x 60 mm; copper layers: Top Layer, Bottom Layer. Coordinates in mm from the lower left corner of the outline.
Outline path: 0,57.5 0,2.5 arc(0.73,0.73) 2.5,0 87.5,0 arc(89.27,0.73) 90,2.5 90,57.5 arc(89.27,59.27) 87.5,60 2.5,60 arc(0.73,59.27) 0,57.5
Stack: Top Layer 0.035mm / Dielectric1 1.51mm FR4 er 4.5 / Bottom Layer 0.035mm

## Design rules (mm)
template: 自定义配置
spacing copperThickness1oz (default): track to track 0.203, other pairs 0.178 to 0.203
spacing copperThickness2oz: track to track 0.203, other pairs 0.152 to 0.3
track width copperThickness1oz (default): min 0.254, default 0.254, max 2.54
track width copperThickness2oz: min 0.203, default 0.254, max 2.54
differential pair differentialPair (default): width min 0.127, default 0.254, max 2.54; gap min 0.152, default 0.152
via viaSize (default): diameter min 0.635, default 0.635, max 10.16; hole min 0.381, default 0.381, max 10.16

## Placement (name value [footprint] x y rotation side)
C1  10uF  [LQ_R0603]  24.89 55.5 90 top
C2  100nF  [LQ_R0603]  21.84 55.5 90 top
C3  100nF  [LQ_C0805]  4.06 32.77 180 top
C4  220uF  [LQ_CAP-SMD_BD6.3-L6.6-W6.6-LS7.3-FD-H7.7]  5.46 38.86 0 top
C5  100nF  [LQ_R0603]  59.56 30.99 180 top
C6  12pF  [LQ_R0603]  42.04 36.7 180 top
C7  10uF  [LQ_R0603]  33.66 24.13 90 top
C8  100nF  [LQ_R0603]  35.05 24.13 270 top
C9  1uF  [LQ_R0603]  36.58 24.13 270 top
C10  100nF  [LQ_R0603]  37.97 24.13 270 top
C11  100nF  [LQ_R0603]  72 20.33 90 top
C12  100nF  [LQ_R0603]  50.55 30.23 180 top
C13  100nF  [LQ_R0603]  24.89 9.65 180 top
C14  100nF  [LQ_C0805]  19.56 15.46 0 top
C15  100nF  [LQ_C0805]  19.56 17.74 0 top
C16  10uF  [LQ_R0603]  40 47.5 90 top
C17  100nF  [LQ_R0603]  37.34 40 90 top
C18  100uF  [LQ_CAP-SMD_BD6.3-L6.6-W6.6-LS7.3-FD-H7.7]  22.99 23.37 270 top
C19  10uF  [LQ_R0603]  16.89 23.11 90 top
C20  100nF  [LQ_R0603]  18.8 23.88 270 top
C21  100nF  [LQ_R0603]  13.46 5.08 270 top
C22  12pF  [LQ_R0603]  45.09 36.7 180 top
C23  100nF  [LQ_R0603]  79.76 20.32 90 top
C27  10nF  [LQ_R0603]  20.83 37.21 0 top
C32  10uF  [LQ_R0603]  13.08 55.63 270 top
C33  100nF  [LQ_R0603]  14.73 55.63 270 top
C34  10uF  [LQ_C0805]  26.03 32.39 180 top
C35  470uF  [LQ_CAP-SMD_BD8.0-L8.3-W8.3-FD]  6.86 23.11 180 top
C37  10uF  [LQ_R0603]  8.64 59.18 180 top
C38  100nF  [LQ_R0603]  30.1 20.45 90 top
C39  100nF  [LQ_R0603]  82.3 17.53 0 top
CN1  -  [LQ_CONN-TH_2P-P5.08_DB128L-5.08-2P]  43.81 54.36 0 top
CN2  -  [LQ_CONN-TH_5P-P2.54_XH-5AW_C2908614]  55.88 4.83 180 top
CN3  -  [LQ_CONN-TH_5P-P2.54_XH-5AW_C2908614]  40.64 4.83 180 top
CN4  -  [LQ_CONN-TH_3P-P5.00_KF2EDGR-5.0-3P]  85.09 45.08 90 top
CN5  -  [LQ_CONN-TH_2P-P5.08_DB128L-5.08-2P]  55.37 54.36 0 top
D2  1N4007  [LQ_SMA_L4.3-W2.5-LS5.0-RD]  66.8 49.4 180 top
D3  SS34  [LQ_SMA_L4.3-W2.6-LS5.0-RD]  27.43 35.43 0 top
D4  SS34  [LQ_SMA_L4.3-W2.6-LS5.0-RD]  27.69 28.19 270 top
D6  -  [LQ_SMB_L4.3-W3.6-LS5.3-RD]  19.05 56.13 90 top
DC1  -  [LQ_DC-IN-TH_DC-005-A200]  6.98 12.7 0 top
F1  -  [LQ_R0805]  16.38 48.13 90 top
F2  -  [LQ_R0805]  26.67 55.88 270 top
F3  -  [LQ_R0603]  19.81 13.72 180 top
H3  -  [LQ_HDR-TH_8P-P2.54-V-F-R2-C4-S2.54-1]  62.74 22.22 180 top
L1  15uH  [LQ_IND-SMD_L10.8-W10.0_SLO1040H]  6.6 48.01 180 top
LED1  -  [LQ_LED0603-RD]  14.86 57.91 0 top
M1  -  [LQ_M3螺丝]  3.5 3.5 0 top
M2  -  [LQ_M3螺丝]  86.87 3.3 0 top
M3  -  [LQ_M3螺丝]  86.5 56.5 0 top
M4  -  [LQ_M3螺丝]  3.5 56.5 0 top
Q1  -  [LQ_SC-75-3_L1.6-W0.8-P1.00-LS1.6-BR]  33.78 50.8 0 top
Q2  S8050-J3Y  [LQ_SOT-23-3_L3.0-W1.7-P0.95-LS2.9-BR]  72.9 24 270 top
Q3  S8050-J3Y  [LQ_SOT-23-3_L3.0-W1.7-P0.95-LS2.9-BR]  76.2 24 270 top
R1  10kΩ  [LQ_R0603]  59.56 32.51 180 top
R2  10kΩ  [LQ_R0603]  14.6 48.21 90 top
R5  10kΩ  [LQ_R0603]  32.77 47.62 270 top
R6  120Ω  [LQ_R0805]  28.57 55.83 90 top
R7  1kΩ  [LQ_R0603]  34.43 47.51 90 top
R8  10kΩ  [LQ_R0603]  35.81 47.5 90 top
R9  10kΩ  [LQ_R0603]  23.37 55.5 90 top
R10  2kΩ  [LQ_R0603]  38.74 40 270 top
R12  4.7kΩ  [LQ_R0603]  50.93 27.05 0 top
R13  4.7kΩ  [LQ_R0603]  50.93 28.58 0 top
R14  4.7kΩ  [LQ_R0603]  78.24 20.31 90 top
R15  2kΩ  [LQ_R0603]  73.53 20.32 270 top
R16  4.7kΩ  [LQ_R0603]  70.49 23.88 90 top
R17  2kΩ  [LQ_R0603]  68.2 51.82 180 top
R18  10K  [LQ_R0603]  68.96 24.13 270 top
R19  1kΩ  [LQ_R0603]  72.26 58.55 180 top
R20  4.7kΩ  [LQ_R0603]  76.58 20.32 90 top
R21  2kΩ  [LQ_R0603]  74.93 20.32 270 top
R22  4.7kΩ  [LQ_R0603]  78.6 23.88 90 top
R23  1kΩ  [LQ_R0603]  70.49 53.34 0 top
R24  10kΩ  [LQ_R0603]  71.12 49.15 90 top
R25  10K  [LQ_R0603]  80.13 23.88 270 top
R27  10kΩ  [LQ_R0603]  15.11 5.08 270 top
R30  2kΩ  [LQ_R0603]  16.26 55.63 270 top
R34  68kΩ  [LQ_R0603]  3.81 30.86 0 top
R35  22kΩ  [LQ_R0603]  7.11 30.73 0 top
R38  100kΩ  [LQ_R0603]  31.62 20.45 90 top
R39  10kΩ  [LQ_R0603]  83.05 19.95 90 top
R40  10kΩ  [LQ_R0603]  28.57 20.45 270 top
R41  -  [LQ_RES-TH_L5.1-W4.3-P3.40-D0.5]  86.74 20.19 180 top
RELAY1  -  [LQ_RELAY-TH_SRD-XXVDC-XL-C_1]  70.99 37.59 270 top
SW1  -  [LQ_SW-SMD_L6.0-W3.3-LS8.0]  58.17 40.39 180 top
U1  -  [LQ_SOD-123FL_L2.8-W1.8-LS3.7-BI]  18.54 48.26 90 top
U2  -  [LQ_SOP-8_L4.9-W3.9-P1.27-LS6.0-BL]  28.07 48.39 90 top
U3  -  [LQ_TQFP-48_L7.0-W7.0-P0.50-LS9.0-BL]  42.42 28.58 180 top
U4  -  [LQ_SOD-123FL_L2.8-W1.8-LS3.7-BI]  23.11 48.26 270 top
U7  -  [LQ_SOD-123FL_L2.8-W1.8-LS3.7-BI]  20.83 48.26 90 top
U8  -  [LQ_DIP-18_L23.0-W6.5-P2.54-LS7.6-BL]  45.21 15.11 180 top
U9  -  [LQ_LED-TH_BD3.9-P2.54-RD_GREEN]  44.07 43.94 180 top
U10  -  [LQ_SOIC-8_L5.3-W5.3-P1.27-LS8.0-BL]  33.53 39.88 180 top
U11  AT24C02  [LQ_SOP-8_L4.9-W3.9-P1.27-LS6.0-BL]  55.75 34.04 180 top
U12  -  [LQ_LED-TH_BD3.9-P2.54-RD_GREEN]  66.04 57.66 0 top
U13  -  [LQ_HDR-TH_6P-P2.54-H-R2-C3-S2.54-W10.0_MTP125-203R1]  82.68 12.32 90 top
U14  GX817C-S  [LQ_SOP-4_L6.5-W4.6-P2.54-LS10.2-TR]  76.07 53.59 0 top
U15  -  [LQ_SOT-23-3_L2.9-W1.3-P1.90-LS2.4-BR]  70.61 55.88 270 top
U16  -  [ESOP]  22.86 38.73 0 top
U17  -  [LQ_SOD-123FL_L2.8-W1.8-LS3.7-BI]  8.64 32.89 0 top
U18  -  [LQ_CONN-TH_3P-P5.08_DIBO_DB128V-5.08-3P-X]  24.13 5.84 0 top
U24  -  [LQ_ESOP-8_L4.9-W3.9-P1.27-LS6.0-TL-EP]  16.38 28.96 0 top
U26  -  [SOT-223-4_L6.5-W3.5-P2.30-LS7.0-BR]  13.33 38.48 270 top
X1  8MHz  [LQ_OSC-SMD_4P-L3.2-W2.5-BL]  43.56 39.37 0 top

## Footprints (pads in the part's own frame, mm; a bottom-side part is the same pattern mirrored in y, then rotated)
ESOP
  oval 0.8x1.6 smd: 1(0,0)
  rect 0.8x1.6 smd: 2(1.397,0) 3(2.794,0) 4(4.064,0) 5(4.064,5.461) 6(2.794,5.461) 7(1.397,5.461) 8(0,5.461)
  rect 3.3x2.4 smd: 9(2.286,2.667)
LQ_C0805
  rect 1.41x1.35 smd: 1(-1,0) 2(1,0)
LQ_CAP-SMD_BD6.3-L6.6-W6.6-LS7.3-FD-H7.7
  rect 3.5x1.2 smd: 1(-2.67,0) 2(2.67,0)
LQ_CAP-SMD_BD8.0-L8.3-W8.3-FD
  rect 4.2x1.4 smd: 1(-3.267,0) 2(3.267,0)
LQ_CONN-TH_2P-P5.08_DB128L-5.08-2P
  round 2.4 hole 1.6: 1(-2.54,0) 2(2.54,0)
LQ_CONN-TH_3P-P5.00_KF2EDGR-5.0-3P
  round 2.5 hole 1.8: 1(-5,0) 2(0,0) 3(5,0)
LQ_CONN-TH_3P-P5.08_DIBO_DB128V-5.08-3P-X
  round 2.3 hole 1.5: 1(-5.08,0) 2(0,0) 3(5.08,0)
LQ_CONN-TH_5P-P2.54_XH-5AW_C2908614
  rect 1.8x1.8 hole 1.1: 1(-5.08,0)
  round 1.8 hole 1.1: 2(-2.54,0) 3(0,0) 4(2.54,0) 5(5.08,0)
LQ_DC-IN-TH_DC-005-A200
  oval 1.5x3.8 hole 0.9x3.1: 1(3,2.325) 2(-3,2.325)
  oval 3.4x1.5 hole 2.6x0.9: 3(0.5,-2.325)
LQ_DIP-18_L23.0-W6.5-P2.54-LS7.6-BL
  rect 1.6x1.6 hole 1: 1(-10.16,-3.81)
  round 1.6 hole 1: 2(-7.62,-3.81) 3(-5.08,-3.81) 4(-2.54,-3.81) 5(0,-3.81) 6(2.54,-3.81) 7(5.08,-3.81) 8(7.62,-3.81) 9(10.16,-3.81) 10(10.16,3.81) 11(7.62,3.81) 12(5.08,3.81) 13(2.54,3.81) 14(0,3.81) 15(-2.54,3.81) 16(-5.08,3.81) 17(-7.62,3.81) 18(-10.16,3.81)
LQ_ESOP-8_L4.9-W3.9-P1.27-LS6.0-TL-EP
  rect 1.3x0.6 smd: 1(-2.7,1.905) 2(-2.7,0.635) 3(-2.7,-0.635) 4(-2.7,-1.905) 5(2.7,-1.905) 6(2.7,-0.635) 7(2.7,0.635) 8(2.7,1.905)
  rect 2.5x3.5 smd: 9(0,0)
LQ_HDR-TH_6P-P2.54-H-R2-C3-S2.54-W10.0_MTP125-203R1
  rect 1.7x1.7 hole 1.2: 1(-2.54,1.27)
  round 1.7 hole 1.2: 2(-2.54,-1.27) 3(0,1.27) 4(0,-1.27) 5(2.54,1.27) 6(2.54,-1.27)
LQ_HDR-TH_8P-P2.54-V-F-R2-C4-S2.54-1
  rect 1.6x1.6 hole 1.1: 1(-3.81,-1.27)
  round 1.6 hole 1.1: 2(-3.81,1.27) 3(-1.27,-1.27) 4(-1.27,1.27) 5(1.27,-1.27) 6(1.27,1.27) 7(3.81,-1.27) 8(3.81,1.27)
LQ_IND-SMD_L10.8-W10.0_SLO1040H
  rect 2.924x3.42 smd: 1(4.778,0) 2(-4.778,0)
LQ_LED0603-RD
  rect 0.8x0.8 smd: 1(-0.799,0) 2(0.799,0)
LQ_LED-TH_BD3.9-P2.54-RD_GREEN
  round 1.6 hole 0.9: 1(-1.27,0) 2(1.27,0)
LQ_M3螺丝
  round 3.2 hole 3.2: 1(0,0)
LQ_OSC-SMD_4P-L3.2-W2.5-BL
  rect 1.4x1.2 smd: 1(-1.1,-0.875) 2(1.1,-0.875) 3(1.1,0.875) 4(-1.1,0.875)
LQ_R0603
  rect 0.806x0.864 smd: 1(-0.753,0) 2(0.753,0)
LQ_R0805
  rect 1.133x1.377 smd: 1(-1,0) 2(1,0)
LQ_RELAY-TH_SRD-XXVDC-XL-C_1
  round 2.794 hole 1.524: 1(-5.1,-6) 2(7.1,-6) 3(7.1,6) 4(-5.1,6) 5(-7.1,0)
LQ_RES-TH_L5.1-W4.3-P3.40-D0.5
  round 1.524 hole 0.762: 1(0,1.7) 2(0,-1.7)
LQ_SC-75-3_L1.6-W0.8-P1.00-LS1.6-BR
  rect 0.816x0.4 smd: 1(0.65,-0.5) 2(0.65,0.5) 3(-0.65,0)
LQ_SMA_L4.3-W2.5-LS5.0-RD
  rect 2x1.593 smd: 1(-2.1,0) 2(2.1,0)
LQ_SMA_L4.3-W2.6-LS5.0-RD
  rect 2.046x1.62 smd: 1(-2.404,-0.009) 2(2.404,0.009)
LQ_SMB_L4.3-W3.6-LS5.3-RD
  rect 2.5x2.3 smd: 1(-2.15,0) 2(2.15,0)
LQ_SOD-123FL_L2.8-W1.8-LS3.7-BI
  rect 1.2x1.4 smd: 1(-1.7,0) 2(1.7,0)
LQ_SOIC-8_L5.3-W5.3-P1.27-LS8.0-BL
  oval 0.63x2.25 smd: 1(-1.905,-3.53) 2(-0.635,-3.53) 3(0.635,-3.53) 4(1.905,-3.53) 5(1.905,3.53) 6(0.635,3.53) 7(-0.635,3.53) 8(-1.905,3.53)
LQ_SOP-4_L6.5-W4.6-P2.54-LS10.2-TR
  rect 1.8x2 smd: 1(1.27,5.1) 2(-1.27,5.1) 3(-1.27,-5.1) 4(1.27,-5.1)
LQ_SOP-8_L4.9-W3.9-P1.27-LS6.0-BL
  oval 0.63x1.865 smd: 1(-1.905,-2.683) 2(-0.635,-2.683) 3(0.635,-2.683) 4(1.905,-2.683) 5(1.905,2.683) 6(0.635,2.683) 7(-0.635,2.683) 8(-1.905,2.683)
LQ_SOT-23-3_L2.9-W1.3-P1.90-LS2.4-BR
  rect 1.25x0.7 smd: 1(1,-0.95) 2(1,0.95) 3(-1,0)
LQ_SOT-23-3_L3.0-W1.7-P0.95-LS2.9-BR
  rect 1.038x0.532 smd: 1(1.101,-0.95) 2(1.101,0.95) 3(-1.101,0)
LQ_SW-SMD_L6.0-W3.3-LS8.0
  rect 1.9x1.5 smd: 1(-4,0) 2(4,0)
LQ_TQFP-48_L7.0-W7.0-P0.50-LS9.0-BL
  oval 0.28x1.8 smd: 1(-2.75,-4.05) 2(-2.25,-4.05) 3(-1.75,-4.05) 4(-1.25,-4.05) 5(-0.75,-4.05) 6(-0.25,-4.05) 7(0.25,-4.05) 8(0.75,-4.05) 9(1.25,-4.05) 10(1.75,-4.05) 11(2.25,-4.05) 12(2.75,-4.05) 25(2.75,4.05) 26(2.25,4.05) 27(1.75,4.05) 28(1.25,4.05) 29(0.75,4.05) 30(0.25,4.05) 31(-0.25,4.05) 32(-0.75,4.05) 33(-1.25,4.05) 34(-1.75,4.05) 35(-2.25,4.05) 36(-2.75,4.05)
  oval 1.8x0.28 smd: 13(4.05,-2.75) 14(4.05,-2.25) 15(4.05,-1.75) 16(4.05,-1.25) 17(4.05,-0.75) 18(4.05,-0.25) 19(4.05,0.25) 20(4.05,0.75) 21(4.05,1.25) 22(4.05,1.75) 23(4.05,2.25) 24(4.05,2.75) 37(-4.05,2.75) 38(-4.05,2.25) 39(-4.05,1.75) 40(-4.05,1.25) 41(-4.05,0.75) 42(-4.05,0.25) 43(-4.05,-0.25) 44(-4.05,-0.75) 45(-4.05,-1.25) 46(-4.05,-1.75) 47(-4.05,-2.25) 48(-4.05,-2.75)
SOT-223-4_L6.5-W3.5-P2.30-LS7.0-BR
  rect 2.47x0.98 smd: 1(2.835,-2.3) 2(2.835,0) 3(2.835,2.3)
  rect 2.47x3.6 smd: 4(-2.835,0)

## Nets
As in the schematic, except:
I2C_SDA: R13.1 U3.43 U11.5

Pads without a net: U3 3 4 38 39 44 45 46; U10 3 7; U16 8; U24 2 3 5

## Via types
v1: diameter 0.635, hole 0.381, Top Layer to Bottom Layer, 176 vias

## Routing (per net, layer and track width the routed paths; a pad name or vN(x,y) marks a point on that pad's centre or on a via; arc(x,y) is an arc through that point)
3V3: length 232.8
  Top Layer w0.254: 45.17,24.4 45.44,24.13 v1(46.1,24.13) ; v1(32.13,24.89) 33.65,24.89 C7.2 ; 83.05,20.7 81.91,19.57 C23.1 R20.1 R21.2 R15.2 73.52,19.58 C11.1 71.86,19.43 v1(70.94,19.43) ; 38.37,25.7 38.37,25.28 C10.1 ; 45.23,31.86 45.17,31.92 U3.1 ; 45.23,31.86 45.76,31.33 U3.48 48.66,31.33 48.74,31.24 50.28,31.24 C12.1 ; 45.23,31.86 45.23,31.37 43.67,29.81 v1(43.57,29.81) ; v1(52.83,28.45) 51.81,28.45 R13.2 ; C10.1 38.25,24.88 v1(39.01,24.13) ; C10.1 C9.1 C8.1 33.91,24.88 ; R13.2 51.68,29.84 52.07,29.84 52.58,29.34 56.13,29.34 57.66,30.86 ; R13.2 51.68,27.18 ; 15.11,4.36 22.65,4.36 U18.2 24.13,9.64 ; R5.2 33.24,46.87 33.86,47.49 36.37,47.49 36.88,46.98 v1(36.94,46.98) 36.94,46.92 36.99,46.87 39.88,46.87 C16.1 39.37,46.74 39.13,46.5 39.13,45.32 37.72,43.92 37.72,41.77 R10.1 C17.2 35.43,38.85 U10.8 39.9,36.35 v1(40.61,35.64) 40.76,35.49 40.76,35.45 41.14,35.07 41.14,31.67 41.04,31.58 v1(41.04,30.55) ; 57.66,30.86 U11.8 58.81,32.5 R1.2 ; 57.66,30.86 57.66,29.21 63.37,23.5 64.01,23.5 H3.4 ; 24.13,9.64 24.01,9.53 v1(22.61,9.53) ; 24.13,9.64 C13.2 ; R27.2 C21.2 ; C32.2 C33.2 R30.2 18.32,54.87 19.06,54.14 21.24,54.14 C2.1 R9.1 C1.1 24.89,53.59 26.65,51.84 26.65,47.39 25.56,46.3 25.18,46.3 v1(25,46.48)
  Top Layer w0.508: U16.2 v1(24.26,36.96) ; C32.2 7.62,49.41 7.62,45.08 11.39,41.32 U26.4 U26.2
  Bottom Layer w0.254: H3.4 v1(64.01,19.18) 64.52,18.67 70.18,18.67 v1(70.94,19.43) ; v1(39.01,24.13) 39.51,23.62 45.59,23.62 v1(46.1,24.13) 47.62,25.65 47.62,28.19 47.8,28.37 52.76,28.37 v1(52.83,28.45) ; v1(41.04,30.55) 41.49,30.11 41.49,29.63 41.87,29.25 42.4,29.25 42.92,29.77 43.57,29.77 ; v1(32.13,24.89) 22.61,15.37 v1(22.61,9.53) ; v1(25,46.48) 25.39,46.48 26.35,47.45 34.16,47.45 35.12,46.48 36.45,46.48 v1(36.94,46.98)
  Bottom Layer w0.508: v1(25,46.48) 24.81,46.29 23.3,46.29 20.83,43.81 20.83,40.39 v1(24.26,36.96)
+5V: length 221.6
  Top Layer w0.254: R17.1 68.95,49.45 D2.1 70.36,47.95 70.36,47.86 70.94,47.27 71.67,47.27 72.46,46.48 77.22,46.48 78.1,47.37 78.1,47.73 U14.4 ; 77.6,48.49 78.73,49.63 78.73,51.43 79.12,51.82 80.81,51.82 81.89,50.74 81.89,50.31 84.96,47.24 84.96,42.67 ; C15.2 C14.2 20.57,15.45 F3.1 22.34,11.94 32,11.94 32.18,11.76 32.25,11.76 32.7,11.3 U8.10 35.56,10.79 35.56,8.51 36.96,7.11 49.91,7.11 50.8,8 50.8,8.51 51.6,8.51 52.83,7.28 62,7.28 63.23,8.51 69.56,8.51 74.87,13.82 77.2,13.82 77.89,14.51 77.89,15.49 77.2,16.18 76.22,16.18 75.53,15.49 73.41,15.49 69.42,19.48 69.42,22.06 R16.1 70.92,23.12 71.54,23.75 77.55,23.75 78.18,23.12 78.6,23.12 R22.1 78.83,23.13 79.56,23.86 86.73,23.86 89.03,26.16 89.03,38.6 84.96,42.67 ; 84.96,42.67 84.96,42.42 ; L1.1 7.49,53.67 7.49,55.3 6.9,55.89 6.89,55.89 6.89,58.19 C37.2
  Top Layer w0.508: 15.64,35.65 15.64,34.81 12.56,31.74 9.55,31.74 8.39,32.89 U17.1 ; D2.1 68.9,47.49 64.96,43.54 ; C15.2 20.56,17.77 19.45,18.88 19.43,18.88 19.25,19.05 18.02,19.05 17.84,18.88 1.32,18.88 0.76,19.43 0.76,28.57 R34.1
+5V-OUT: length 74
  Top Layer w0.254: 76.71,12.46 79.25,12.46 ; 38.85,0.55 41.53,0.57
  Top Layer w0.508: F3.2 18.77,13.43 18.77,12.71 20.16,11.32 31.72,11.32 32.67,10.37 32.67,6.24 38.31,0.59 38.85,0.59 ; 76.71,12.46 64.84,0.59 41.51,0.59 41.53,0.57
+12V: length 7.7
  Top Layer w0.508: U16.3 25.65,37.46 26.92,36.19 26.92,34.67 25.03,32.78 C34.2
GND: length 249.3
  Top Layer w0.254: v1(31.1,25.92) 33.4,25.92 33.8,26.33 U3.23 ; v1(42.02,34.11) 42.02,33.9 41.7,33.58 41.7,33.3 41.67,33.27 ; v1(24.26,51.56) 25.38,50.43 U2.5 ; 19.06,58.44 19.83,58.44 20.7,59.31 21.21,59.31 v1(21.65,58.86) 21.65,56.44 C2.2 ; v1(30.09,43.18) 31.4,43.18 U10.4 ; v1(16.51,17.4) 18.22,17.4 C15.1 C14.1 ; U15.2 72.88,54.88 v1(72.9,54.86) ; v1(88.65,17.14) 87.3,18.49 86.87,18.49 ; C37.1 12.79,59.18 v1(13.1,58.87) LED1.1 ; U3.35 44.7,24.5 44.7,23.57 45.1,23.17 v1(46.82,23.17) ; v1(32,23.24) 33.52,23.24 ; 33.52,23.24 C7.1 ; 33.52,23.24 34.92,23.24 C8.2 C9.2 C10.2 ; C39.2 85.04,17.53 v1(85.46,17.11) ; v1(70.88,21.13) 71.95,21.13 C11.2 ; C12.2 49.67,30.35 v1(48.26,30.35) 47.79,30.83 U3.47 ; R24.1 72.51,48.4 v1(72.84,48.72) ; 50.79,32 v1(52.07,32) ; v1(24.3,55.7) 24.34,55.7 C1.2 ; v1(37.59,45.97) 36.58,45.97 R8.1 ; 30.01,35.45 30.01,33.32 v1(29.84,33.15) 29.08,32.39 C34.1 ; H3.2 v1(66.55,19.34) ; C23.2 80.51,21.07 v1(81.53,22.1) ; C16.2 38.98,49.28 v1(37.59,49.28) 35.57,51.3 Q1.2 33.71,51.3 33.68,51.33 31.79,51.33 U2.4 30.75,50.78 30.05,51.49 v1(27.86,51.49)
  Top Layer w0.508: 18.03,22.11 16.38,22.11 15.37,21.09 v1(14.35,21.09) ; v1(43.79,34.12) 43.76,34.15 43.76,34.65 45.67,36.56 45.72,36.56 ; 45.94,38.71 45.69,38.47 44.87,38.47 ; C4.2 7.75,38.86 v1(6.48,37.59) ; 42.22,40.31 42.22,41.17 41.86,41.53 ; 41.86,41.53 45.53,41.53 46.04,41.02 46.04,36.8 46.05,36.78 ; 41.86,41.53 41.78,41.53 41.28,41.03 C6.2 ; 41.24,36.49 v1(41.94,35.79) 41.94,34.18 v1(42.02,34.11) ; U17.2 11.03,33.59 U26.1 ; v1(72.9,39.88) 72.41,40.37 62.03,40.37 ; R35.1 5.05,32.04 5.05,32.76 C3.1
  Bottom Layer w0.254: v1(14.35,21.09) 14.35,19.56 v1(16.51,17.4) ; v1(81.53,22.1) 85.46,18.17 v1(85.46,17.11) ; v1(13.1,58.87) 6.29,58.87 3.92,56.5 M4.1 ; v1(66.55,19.34) 69.08,19.34 v1(70.88,21.13) 73.39,21.13 76.44,18.08 84.49,18.08 v1(85.46,17.11) ; v1(27.86,51.49) 27.78,51.56 v1(24.26,51.56) 24.26,55.66 v1(24.3,55.7) 24.3,56.22 v1(21.65,58.86) ; 79.25,9.92 85.87,3.3 M2.1 88.65,5.08 v1(88.65,17.14) 88.61,17.11 v1(85.46,17.11) ; v1(72.84,48.72) 72.84,54.81 v1(72.9,54.86) 74.68,56.64 v1(74.68,58.67) ; v1(29.84,33.15) 29.84,42.94 v1(30.09,43.18) ; v1(37.59,45.97) v1(37.59,49.28) ; v1(48.26,30.35) 50.42,30.35 v1(52.07,32)
  Bottom Layer w0.508: v1(5.06,32.89) 5.06,36.18 v1(6.48,37.59) ; v1(72.9,39.88) 73.07,40.06 73.07,48.64 72.99,48.72 v1(72.84,48.72)
  vias: v1(5.44,55.15) v1(5.44,15.6) v1(5.44,10.52) v1(5.44,5.44) v1(6.45,27.92) v1(6.45,22.84) v1(7.22,42.51) v1(7.22,37.43) v1(10.52,15.6) v1(10.52,10.52) v1(10.52,5.44) v1(12.3,57.75) v1(12.3,37.43) v1(13.31,52.1) v1(15.6,15.6) v1(15.6,10.52) v1(17.38,57.75) v1(17.38,37.43) v1(21.69,22.84) v1(22.46,57.75) v1(26.77,53.32) v1(26.77,27.92) v1(26.77,17.76) v1(30.84,5.44) v1(31.85,58.4) v1(31.85,17.76) v1(36.93,58.4) v1(36.93,48.24) v1(36.93,38.08) v1(36.93,12.68) v1(41.14,38.3) v1(41.15,36.75) v1(41.33,40.97) v1(41.86,41.59) v1(42.01,58.4) v1(42.01,48.24) v1(42.01,27.92) v1(42.01,12.68) v1(44.66,35.54) v1(45.54,41.48) v1(45.91,36.72) v1(46.11,40.84) v1(46.11,38.27) v1(47.09,58.4) v1(47.09,48.24) v1(47.09,33) v1(47.09,12.68) v1(52.17,58.4) v1(52.17,48.24) v1(52.17,43.16) v1(52.17,33) v1(52.17,12.68) v1(57.25,58.4) v1(57.25,48.24) v1(57.25,43.16) v1(57.25,33) v1(57.25,22.84) v1(57.25,17.76) v1(57.25,12.68) v1(62.33,58.4) v1(62.33,53.32) v1(62.33,48.24) v1(62.33,38.08) v1(62.33,33) v1(62.33,17.76) v1(62.33,12.68) v1(67.41,38.08) v1(67.41,33) v1(67.41,17.76) v1(67.41,12.68) v1(72.49,38.08) v1(72.49,12.68) v1(73.01,53.03) v1(73.01,47.95) v1(75.63,5.44) v1(77.57,27.92) v1(78.09,53.03) v1(80.71,10.52) v1(80.71,5.44) v1(82.65,33) v1(82.65,27.92) v1(83.17,58.11) v1(83.17,53.03) v1(85.79,10.52) v1(85.79,5.44) v1(87.73,38.08) v1(87.73,33) v1(87.73,27.92) v1(88.25,58.11) v1(88.25,53.03) v1(88.25,47.95) v1(88.25,42.87)
VIN: length 26.9
  Top Layer w0.508: 27.7,25.74 27.74,25.7 v1(27.74,23.07) 28.12,23.45 30.52,23.45 31.62,22.35 R38.2
  Bottom Layer w0.508: 13.48,12.7 17.46,12.7 27.74,22.98 v1(27.74,23.07)
485_A: length 14.8
  Top Layer w0.254: CN1.1 40.8,54.83 R6.1 28.52,54.88 F2.2
485_B: length 41.1
  Top Layer w0.254: F1.2 v1(16.38,50.92) ; v1(28.57,59.14) R6.2 43.88,56.83 CN1.2
  Bottom Layer w0.254: v1(16.38,50.92) 20.45,54.99 20.45,58.67 21.34,59.56 28.32,59.56 28.57,59.31 v1(28.57,59.14)
485_RX: length 27.4
  Top Layer w0.254: U3.22 33.65,26.83 33.34,26.52 32.81,26.52 32.5,26.83 30.95,26.83 v1(30.87,26.9) ; v1(30.73,45.34) 30.75,45.35 U2.1
  Bottom Layer w0.254: v1(30.73,45.34) 30.73,27.04 v1(30.87,26.9)
485_TX: length 26
  Top Layer w0.254: 34.43,46.75 34.43,46.66 v1(33.38,45.62) ; U3.21 33.24,27.33 v1(33.08,27.17)
  Bottom Layer w0.254: v1(33.08,27.17) 32.89,27.35 32.85,27.35 32.51,27.69 32.51,44.75 v1(33.38,45.62)
ADC_IN0: length 27.3
  Top Layer w0.254: 40.67,32.5 40.67,34.62 v1(40.49,34.8) ; v1(36.96,20.83) 33.53,20.83 32.39,19.69 R38.1 C38.1 R40.2
  Bottom Layer w0.254: v1(36.96,20.83) 38.35,22.22 38.35,33.77 39.38,34.8 v1(40.49,34.8)
ADC_IN1: length 59.1
  Top Layer w0.254: 86.87,21.89 84.17,19.19 R39.1 83.05,19.03 81.65,17.63 ; 40.17,32.5 40.17,30.23 v1(40.82,29.58) ; 81.65,17.63 C39.1 ; 81.65,17.63 v1(81.65,18.73)
  Bottom Layer w0.254: v1(40.82,29.58) 40.82,29.43 41.59,28.66 47.45,28.66 47.62,28.83 52.18,28.83 53.62,30.28 54.48,30.28 54.85,30.65 55.39,30.65 55.76,30.28 63.03,30.28 64.15,29.16 72.09,29.16 78.89,22.36 78.89,21.81 81.55,19.15 81.55,18.82 v1(81.65,18.73)
I2C_SCL: length 13.9
  Top Layer w0.254: U3.42 48.9,28.33 R12.1 50.94,26.29 53.97,26.29 55.12,27.43 55.12,28.45 ; v1(55.12,30) U11.6
  Bottom Layer w0.254: v1(55.12,28.42) v1(55.12,30)
I2C_SDA: length 11.6
  Top Layer w0.254: v1(52.83,30.86) 53.36,30.86 U11.5 ; 48.6,28.83 48.73,28.96 49.79,28.96 R13.1 ; 48.6,28.83 v1(47.91,29.52) ; 48.6,28.83 U3.43
  Bottom Layer w0.254: v1(52.83,30.86) 51.49,29.52 v1(47.91,29.52)
MOT1_INA: length 28.9
  Top Layer w0.254: v1(35.42,34.29) 38,34.29 U3.12
  Top Layer w0.508: v1(25.52,45.43) 25.65,45.3 U16.6
  Bottom Layer w0.254: v1(35.42,34.29) 35.42,45.54 33.97,46.99 26.54,46.99 25.77,46.22 25.77,45.69 v1(25.52,45.43)
MOT1_INB: length 30.5
  Top Layer w0.254: U3.13 36.93,32.77 v1(34.93,32.77)
  Top Layer w0.508: U16.7 v1(24.26,45.52)
  Bottom Layer w0.254: v1(34.93,32.77) 34.93,33.87 34.77,34.02 34.77,34.56 34.93,34.71 34.93,45.39 33.96,46.36 29.97,46.36 27.98,44.37 25.41,44.37 v1(24.26,45.52)
MOT1_OUTA: length 37.9
  Top Layer w0.508: v1(28.35,49.51) 28.07,49.22 28.07,40.83 26.92,39.68 U16.4
  Bottom Layer w0.508: v1(28.35,49.51) 28.35,49.6 31.46,52.7 51.18,52.7 CN5.1
MOT1_OUTB: length 39.5
  Top Layer w0.508: v1(27.69,50.03) 27.23,49.57 27.23,44.5 U16.5
  Bottom Layer w0.508: CN5.2 56.26,56.01 53.52,56.01 53.52,56.01 33.66,56.01 27.69,50.04 v1(27.69,50.03)
MOT_A1: length 3
  Top Layer w0.254: 38.1,8.51 38.1,10.79 U8.11
MOT_A2: length 3
  Top Layer w0.254: 40.64,8.51 40.64,10.79 U8.12
MOT_A3: length 3
  Top Layer w0.254: U8.13 43.18,10.79 43.18,8.51
MOT_A4: length 3
  Top Layer w0.254: U8.14 45.72,10.79 45.72,8.51
MOT_B1: length 6.7
  Top Layer w0.254: U8.15 49.32,9.74 51.31,9.74 52.54,8.51 53.34,8.51
MOT_B2: length 6.7
  Top Layer w0.254: 55.88,8.51 55.25,9.14 54.44,9.14 53.85,9.74 52.11,9.74 50.55,11.3 U8.16
MOT_B3: length 6.7
  Top Layer w0.254: 58.42,8.51 57.19,9.74 54.78,9.74 53.21,11.3 U8.17
MOT_B4: length 6.7
  Top Layer w0.254: U8.18 58.17,11.3 60.96,8.51
OSC_IN: length 7.8
  Top Layer w0.254: X1.3 44.09,39.68 44.08,39.68 43.88,39.49 43.88,39.47 43.84,39.42 43.82,39.42 43.63,39.23 43.63,37.76 44.33,37.06 C22.2 ; 43.14,33.42 43.14,35.33 44.26,36.45
OSC_OUT: length 5.5
  Top Layer w0.254: 42.7,33.05 42.66,33.08 42.66,36.44 ; 42.8,36.7 43.05,36.96 43.05,37.9 X1.1
PB0/DS18B20: length 41.2
  Top Layer w0.254: U3.18 34.04,28.83 33.15,29.72 30.01,29.72 v1(29.97,29.76)
  Top Layer w0.508: U18.1 19.04,5.83 R27.1
  Bottom Layer w0.254: U18.1 19.05,13.46 29.97,24.38 v1(29.97,29.76)
PB4/PWM1: length 39.3
  Top Layer w0.254: v1(48.77,26.85) 48.72,26.9 48.01,26.9 47.59,27.33 U3.40 ; Q2.2 73.3,22.35 v1(72.9,22.35) ; v1(78.24,22.09) R14.2
  Bottom Layer w0.254: v1(48.77,26.85) 49,26.61 49,25.67 49.38,25.29 50.33,25.29 50.34,25.27 58.8,25.27 60.34,23.74 60.34,23.03 61,22.36 61.71,22.36 61.72,22.35 72.9,22.35 v1(72.9,22.35) 75.11,20.14 75.11,20.05 75.49,19.67 76.06,19.67 78.24,21.85 v1(78.24,22.09)
PB5/PWM2: length 35.6
  Top Layer w0.254: Q3.2 77.15,21.64 R20.2 75.83,20.32 v1(75.76,20.32) ; v1(48.28,27.55) 48,27.83 U3.41
  Bottom Layer w0.254: v1(48.28,27.55) 68.54,27.55 73.08,23 73.17,23 73.55,22.62 73.55,22.54 v1(75.76,20.32)
PC13/LED: length 12.3
  Top Layer w0.254: 45.34,44.01 46.89,42.45 46.89,36.36 44.66,34.12 44.66,33.29 44.7,33.26
PWM1-DOUT: length 14.2
  Top Layer w0.254: 76.71,15 72.25,15 68.96,18.29 R18.2
PWM2-DOUT: length 26.1
  Top Layer w0.254: R25.2 80.37,23.37 88.14,23.37 89.41,22.1 89.41,16.76 88.77,16.13 80.38,16.13 79.25,15
RELAY1: length 63.2
  Top Layer w0.254: R19.2 71.13,58.93 v1(69.98,58.93) ; U3.19 38.34,28.35 33.86,28.35 33.73,28.48 v1(33.47,28.48)
  Bottom Layer w0.254: v1(69.98,58.93) 69.28,59.63 69.15,59.63 68.44,58.92 68.44,57.19 58.62,47.37 43.18,47.37 39.88,44.07 39.88,37.72 36.96,34.8 36.96,31.22 34.51,28.77 33.75,28.77 v1(33.47,28.48)
RST: length 32.4
  Top Layer w0.254: 54.03,40.37 52.14,38.48 v1(52.14,35.85) ; 54.85,37.98 53.78,39.05 53.78,39.73 ; 54.85,37.98 57.93,37.98 58.3,37.6 58.3,34.53 R1.1 C5.1 ; 42.17,32.5 42.17,30.69 v1(42.24,30.62)
  Bottom Layer w0.254: 52.14,35.76 51.36,35.76 46.2,30.61 42.31,30.61
SPI_CS: length 17.4
  Top Layer w0.254: U10.1 36.19,44.17 v1(36.19,44.58) ; U3.14 38.34,30.86 36.69,30.86 36.32,31.23 v1(36.05,31.23)
  Bottom Layer w0.254: 36.06,31.23 36.06,31.76 36.07,31.78 36.07,44.45 v1(36.19,44.58)
SPI_MISO: length 21.4
  Top Layer w0.254: U3.16 35.55,29.83 v1(34.21,31.17) ; 34.16,43.41 34.16,45.22 v1(34.17,45.22)
  Bottom Layer w0.254: v1(34.21,31.17) 33.27,32.1 33.27,44.33 v1(34.17,45.22)
SPI_MOSI: length 11.7
  Top Layer w0.254: U3.17 35.14,29.33 31.62,32.84 U10.5
SPI_SCK: length 9.7
  Top Layer w0.254: U3.15 35.97,30.33 32.89,33.4 U10.6
STEP_A1: length 18.3
  Top Layer w0.254: v1(31.5,27.81) 38.36,27.81 U3.20
  Bottom Layer w0.254: v1(31.5,27.81) 31.5,27.19 32.78,25.91 32.78,23.74 U8.8
STEP_A2: length 5.7
  Top Layer w0.254: U8.7 39.67,19.39 39.67,24.4
STEP_A3: length 6.7
  Top Layer w0.254: 40.17,24.4 40.17,21.05 42.29,18.92 U8.6
STEP_A4: length 8.7
  Top Layer w0.254: U8.5 44.07,20.07 42.42,20.07 42.41,20.05 41.82,20.05 40.67,21.21 40.67,24.4
STEP_B1: length 10.6
  Top Layer w0.254: 41.17,24.4 41.17,21.44 42.09,20.52 46.15,20.52 U8.4
STEP_B2: length 12.5
  Top Layer w0.254: 41.67,24.4 41.67,21.86 41.66,21.84 41.66,21.6 42.28,20.98 48.23,20.98 U8.3
STEP_B3: length 13.1
  Top Layer w0.254: U8.2 51.82,18.92 51.42,19.32 51.42,19.39 49.38,21.44 44.3,21.44 43.49,22.25 43.49,22.43 43.46,22.45 43.46,22.81 43.16,23.12 43.16,24.39 43.17,24.4
STEP_B4: length 15
  Top Layer w0.254: U8.1 54.74,18.92 51.91,21.75 49.71,21.75 49.46,22 44.38,22 43.94,22.44 43.94,22.98 43.61,23.31 43.61,23.42 43.64,23.44 43.64,24.37 43.67,24.4
SWCLK: length 16.1
  Top Layer w0.254: 46.47,25.7 49.41,25.7 v1(49.65,25.94)
  Bottom Layer w0.254: 61.47,23.5 59.03,25.94 v1(49.65,25.94)
SWDIO: length 17.5
  Top Layer w0.254: 58.93,23.5 58.93,23.11 57.51,21.7 52.61,21.7 51.85,22.46 45.11,22.46 44.14,23.43 44.14,24.37 44.17,24.4
UART1_RXD: length 21.2
  Top Layer w0.254: 42.67,24.4 42.67,22.69 v1(42.82,22.54)
  Bottom Layer w0.254: v1(42.82,22.54) 46.53,22.54 46.55,22.52 47.08,22.52 47.09,22.52 56.22,22.52 56.64,22.1 60.32,22.1 H3.6
UART1_TXD: length 19.8
  Top Layer w0.254: v1(42.44,21.73) 42.17,22 42.17,24.4
  Bottom Layer w0.254: H3.8 58.67,20.7 56.13,20.7 55.1,21.73 v1(42.44,21.73)
$1N1864: length 6.2
  Top Layer w0.254: 42.75,43.8 42.67,43.8 40.7,41.83 40.7,41.27 38.74,39.31
$1N51292: length 2
  Top Layer w0.254: Q3.1 75.25,21.39 R21.1
$1N51297: length 4.1
  Top Layer w0.254: Q3.3 78.14,25.1 R22.2 R25.1
$1N64291: length 6.1
  Top Layer w0.254: U2.3 U2.2 32.14,47.75 R5.1 33.13,48.74 Q1.3
$1N64303: length 12.4
  Top Layer w0.254: U2.7 25.02,47.75 24.13,46.86 23.42,46.86 U4.2 22.59,46.56 21.67,47.49 19.99,47.49 19.06,46.56 U1.1 17.97,47.13 F1.1 14.93,47.13 R2.1
$1N64306: length 16.3
  Top Layer w0.254: U4.1 24.13,49.96 25.07,49.02 U2.6 ; U4.1 U7.2 ; U4.1 23.11,51.74 v1(22.9,51.96) ; F2.1 26.85,57.06 26.85,57.35 26.67,57.53 24.65,57.53 R9.2 22.77,55.66 v1(22.76,55.66)
  Bottom Layer w0.254: v1(22.9,51.96) 22.9,55.52 v1(22.76,55.66)
$1N64546: length 3.4
  Top Layer w0.254: R8.2 35.81,48.26 R7.2 34.43,48.27 Q1.1
$1N100307: length 6.3
  Top Layer w0.254: U14.3 74.8,49.78 R23.2
$1N100313: length 22
  Top Layer w0.508: 80.31,50.08 80.58,49.82 80.58,49.58 82.31,47.85 82.31,36.39 77.26,31.34 76.96,31.34
$1N100314: length 5.6
  Top Layer w0.254: R24.2 71.12,51.95 R23.1 69.73,54.81 U15.1
$1N100315: length 38.5
  Top Layer w0.254: D2.2 64.7,57.59 U12.1 65.71,57.66 66.84,58.79 67.78,58.79 68.91,57.66 69.83,57.66 U15.3
  Top Layer w0.508: D2.2 64.04,48.74 64.04,45.75 62.57,44.28 62.57,42.85 63.8,41.62 66.14,41.62 68.09,43.56 76.94,43.56 76.96,43.54
$1N100316: length 19
  Top Layer w0.508: 80.31,40.08 71.57,31.34 64.96,31.34
$1N100317: length 9.5
  Top Layer w0.508: 80.31,45.08 79.85,45.54 70.96,45.54
$1N101166: length 7.9
  Top Layer w0.254: R19.1 73.02,56.65 73.79,55.88 74.8,55.88 77.34,58.42 U14.1
$1N101509: length 6.9
  Top Layer w0.254: Q2.1 71.57,22.9 70.1,21.44 70.1,20.98 70.74,20.35 72.57,20.35 72.76,20.54 72.76,20.55 73.29,21.07 R15.1
$1N101514: length 4.2
  Top Layer w0.254: R18.1 70.23,24.88 R16.2 72.42,24.63 Q2.3
$1N108709: length 5.9
  Top Layer w0.254: U12.2 67.45,57.52 R17.2
$1N118569: length 1.8
  Top Layer w0.254: LED1.2 16.26,57.31 R30.1
$1N118588: length 7.4
  Top Layer w0.508: U24.8 21.58,33.36 C27.2
$1N118591: length 7.3
  Top Layer w0.508: U24.4 11.55,27.05 R35.2
$1N118592: length 9
  Top Layer w0.508: C27.1 20.03,37.21 U24.1

## Copper pours and planes (outline as drawn; the poured copper is in the pictures)
+5V on Top Layer: 2.72,30.52 3.39,30.52 3.43,30.48 3.43,31.7 3.81,32.08 3.81,33.73 4.06,33.98 6.15,33.98 6.35,33.78 6.35,32.18 7.58,32.18 7.58,33.58 6.49,34.67 3.56,34.67 2.41,33.53 2.41,32.02 2.72,31.72
+5V on Top Layer: 1.14,38.23 4.44,38.23 4.44,45.21 3.3,46.36 3.3,49.53 3.17,49.66 0.42,49.66 0.42,46.26 0.38,46.23 0.38,40 1.02,39.37 1.02,38.35
+5V on Top Layer: 2.25,32.08 3.63,32.08 3.68,32.13 3.68,33.39 1.78,35.3 1.78,37.97 2.03,38.23 4.47,38.23 4.47,39.46 1.07,39.46 1.07,33.27
+12V on Top Layer: 18.43,29.28 28.52,29.28 28.57,29.34 28.57,31.37 28.7,31.5 25.91,31.5 25.78,31.62 25.78,32.89 25.65,33.02 24.33,33.02 24.33,31.62 21.46,31.62 19.69,29.84 18.44,29.84 18.44,29.29
+12V on Top Layer: 7.99,22.45 14.76,22.45 20.48,25.08 25.6,29.34 28.7,29.34 28.7,31.49 25.83,31.49 15.73,23.72 7.99,23.72
GND on Top Layer: -8.02,64.41 101.2,64.41 101.2,-7.09 -8.02,-7.09
GND on Bottom Layer: -14.41,73.07 104.17,73.07 104.17,-6.72 -14.41,-6.72
$1N118588 on Top Layer: 25.78,34.67 23.75,34.67 23.75,35.09 23.71,35.09 23.62,35.18 22.82,35.18 22.8,35.83 21.59,36.83 21.29,36.83 21.29,37.16 11.96,46.48 9.65,46.48 9.53,46.36 9.53,49.53 9.65,49.66 12.37,49.66 12.37,47.57 23.75,36.19 25.78,36.19
$1N118591 on Top Layer: 7.49,31.13 16.28,31.13 17.14,32 18.48,32 18.48,31.56 17.14,30.23 7.62,30.23 7.49,30.35 7.49,31.13
$1N118591 on Top Layer: 4.16,31.26 5,31.26 5,30.3 5.59,29.72 7.11,29.72 7.49,30.1 7.49,31.13 8.28,31.13 8.28,30.3 7.19,29.21 5.46,29.21 4.18,30.44 4.16,31.15
